# EAGLE schematic smoothieboard-10x10-1210 (EAGLE 9.6.0)

## Sheet 1 of 4
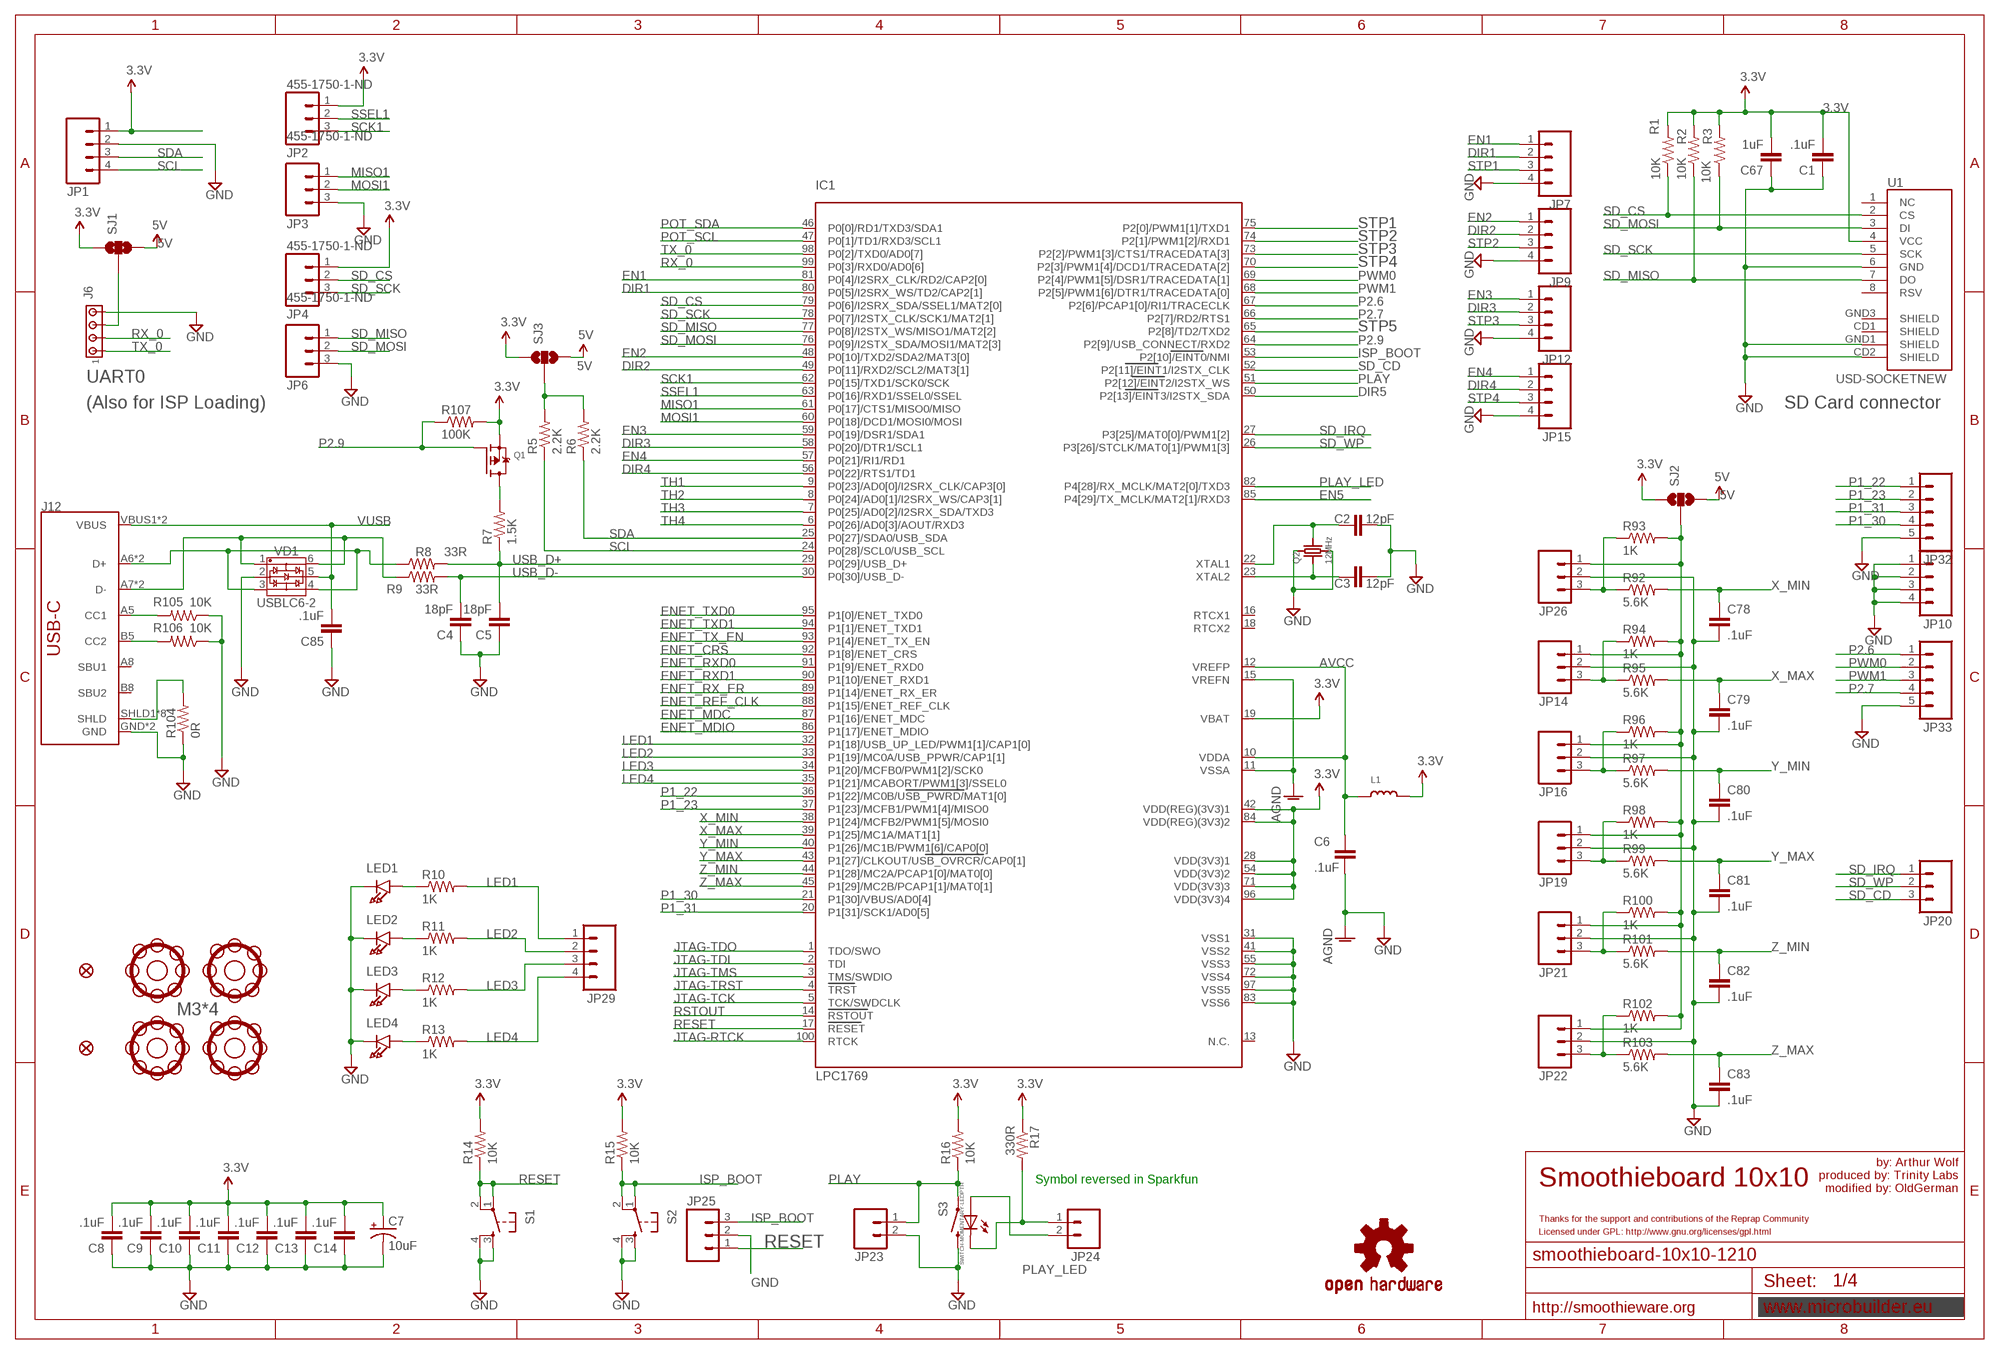
[diagram p0: schematic, sheet 1]

### Parts
C1  .1uF  C-EU  [0603]
C2  12pF  C-EU  [0603]
C3  12pF  C-EU  [0603]
C4  18pF  C-EU  [0603]
C5  18pF  C-EU  [0603]
C6  .1uF  C-EU  [0603]
C7  10uF  CAP_POL1206  [EIA3216]
C8  .1uF  C-EU  [0603]
C9  .1uF  C-EU  [0603]
C10  .1uF  C-EU  [0603]
C11  .1uF  C-EU  [0603]
C12  .1uF  C-EU  [0603]
C13  .1uF  C-EU  [0603]
C14  .1uF  C-EU  [0603]
C67  1uF  C-EUC0603  [C0603]
C78  .1uF  C-EU  [0603]
C79  .1uF  C-EU  [0603]
C80  .1uF  C-EU  [0603]
C81  .1uF  C-EU  [0603]
C82  .1uF  C-EU  [0603]
C83  .1uF  C-EU  [0603]
C85  .1uF  C-EU  [0603]
FID1  FIDUCIAL  [FIDUCIAL_1MM]
FID2  FIDUCIAL  [FIDUCIAL_1MM]
IC1  LPC1769  LPC1768  [LQFP100]
J6  MTA04-100  [10X04MTA_ROUND]
J12  USB_C_LONG-SYMBOL2-LAYER  [USB-C-16P]
JP1  CONN_04PTH  [1X04]
JP2  455-1750-1-ND  CONN_03  [1X03]
JP3  455-1750-1-ND  CONN_03  [1X03]
JP4  455-1750-1-ND  CONN_03  [1X03]
JP6  455-1750-1-ND  CONN_03  [1X03]
JP7  CONN_04PTH  [1X04]
JP9  CONN_04PTH  [1X04]
JP10  CONN_04PTH  [1X04]
JP12  CONN_04PTH  [1X04]
JP14  M03POLAR  [MOLEX-1X3]
JP15  CONN_04PTH  [1X04]
JP16  M03POLAR  [MOLEX-1X3]
JP19  M03POLAR  [MOLEX-1X3]
JP20  M03PTH  [1X03]
JP21  M03POLAR  [MOLEX-1X3]
JP22  M03POLAR  [MOLEX-1X3]
JP23  M02PTH  [1X02]
JP24  M02PTH  [1X02]
JP25  M03PTH  [1X03@1]
JP26  M03POLAR  [MOLEX-1X3]
JP29  CONN_04PTH  [1X04]
JP32  M05PTH  [1X05]
JP33  M05PTH  [1X05]
L1  INDUCTOR0603  [0603]
LED1  LED0805  [CHIPLED_0805]
LED2  LED0805  [CHIPLED_0805]
LED3  LED0805  [CHIPLED_0805]
LED4  LED0805  [CHIPLED_0805]
Q1  MOSFET-P  [SOT23-R]
Q2  12MHz  CRYSTALTHIN  [CRYSTAL_3.2X2.5]
R1  10K  R-US_  [0603]
R2  10K  R-US_  [0603]
R3  10K  R-US_  [0603]
R5  2.2K  R-US_  [0603]
R6  2.2K  R-US_  [0603]
R7  1.5K  R-US_  [0603]
R8  33R  R-US_  [0603]
R9  33R  R-US_  [0603]
R10  1K  R-US_  [0603]
R11  1K  R-US_  [0603]
R12  1K  R-US_  [0603]
R13  1K  R-US_  [0603]
R14  10K  R-US_  [0603]
R15  10K  R-US_  [0603]
R16  10K  R-US_  [0603]
R17  330R  R-US_  [0603]
R92  5.6K  R-US_  [0603]
R93  1K  R-US_  [0603]
R94  1K  R-US_  [0603]
R95  5.6K  R-US_  [0603]
R96  1K  R-US_  [0603]
R97  5.6K  R-US_  [0603]
R98  1K  R-US_  [0603]
R99  5.6K  R-US_  [0603]
R100  1K  R-US_  [0603]
R101  5.6K  R-US_  [0603]
R102  1K  R-US_  [0603]
R103  5.6K  R-US_  [0603]
R104  0R  R-US_  [0603]
R105  10K  R-US_  [0603]
R106  10K  R-US_  [0603]
R107  100K  R-US_  [0603]
S1  TAC_SWITCHSMD  [TACTILE_SWITCH_SMD]
S2  TAC_SWITCHSMD  [TACTILE_SWITCH_SMD]
S3  SWITCH-MOMENTARY-LEDPTH  [TACTILE-PTH-LED-12MM]
SJ1  SOLDERJUMPER_2WAYS  [SJ_3]
SJ2  SOLDERJUMPER_2WAYS  [SJ_3]
SJ3  SOLDERJUMPER_2WAYS  [SJ_3]
U1  USD-SOCKETNEW  [MICRO-SD-SOCKET-PP]
U$9  OSHW-LOGOH  [OSHW-LOGO-HUGE]
U$13  SUN_HOLE_M3  [SUN_HOLE_M3]
U$14  SUN_HOLE_M3  [SUN_HOLE_M3]
U$16  SUN_HOLE_M3  [SUN_HOLE_M3]
U$18  SUN_HOLE_M3  [SUN_HOLE_M3]
VD1  USBLC6-2  USBLC6-2SOT23-6  [SOT23-6]

### Nets
3.3V: C1.2 C7.A(+) C8.2 C9.2 C10.2 C11.2 C12.2 C13.2 C14.2 C67.2 IC1.19(VBAT) IC1.28(VDD(3V3)1) IC1.42(VDD(REG)(3V3)1) IC1.54(VDD(3V3)2) IC1.71(VDD(3V3)3) IC1.84(VDD(REG)(3V3)2) IC1.96(VDD(3V3)4) JP1.1 JP2.1 JP4.1 L1.2 Q1.2(S) R1.2 R2.2 R3.2 R14.2 R15.2 R16.2 R17.1 R107.2 SJ1.1 SJ2.1 SJ3.1 U1.4(VCC) ; also sheet 2,3,4
5V: SJ1.3 SJ2.3 SJ3.3 ; also sheet 4
AGND: C6.2 IC1.11(VSSA) IC1.15(VREFN) ; supply symbol labelled GND ; also sheet 2
AVCC: C6.1 IC1.10(VDDA) IC1.12(VREFP) L1.1 ; also sheet 2
DIR1: IC1.80(P0[5]/I2SRX_WS/TD2/CAP2[1]) JP7.2 ; also sheet 2
DIR2: IC1.49(P0[11]/RXD2/SCL2/MAT3[1]) JP9.2 ; also sheet 2
DIR3: IC1.58(P0[20]/DTR1/SCL1) JP12.2 ; also sheet 2
DIR4: IC1.56(P0[22]/RTS1/TD1) JP15.2 ; also sheet 2
DIR5: IC1.50(P2[13]/EINT3/I2STX_SDA) ; also sheet 4
EN1: IC1.81(P0[4]/I2SRX_CLK/RD2/CAP2[0]) JP7.1 ; also sheet 2
EN2: IC1.48(P0[10]/TXD2/SDA2/MAT3[0]) JP9.1 ; also sheet 2
EN3: IC1.59(P0[19]/DSR1/SDA1) JP12.1 ; also sheet 2
EN4: IC1.57(P0[21]/RI1/RD1) JP15.1 ; also sheet 2
EN5: IC1.85(P4[29]/TX_MCLK/MAT2[1]/RXD3) ; also sheet 4
ENET_CRS: IC1.92(P1[8]/ENET_CRS) ; also sheet 3
ENET_MDC: IC1.87(P1[16]/ENET_MDC) ; also sheet 3
ENET_MDIO: IC1.86(P1[17]/ENET_MDIO) ; also sheet 3
ENET_REF_CLK: IC1.88(P1[15]/ENET_REF_CLK) ; also sheet 3
ENET_RX_ER: IC1.89(P1[14]/ENET_RX_ER) ; also sheet 3
ENET_RXD0: IC1.91(P1[9]/ENET_RXD0) ; also sheet 3
ENET_RXD1: IC1.90(P1[10]/ENET_RXD1) ; also sheet 3
ENET_TX_EN: IC1.93(P1[4]/ENET_TX_EN) ; also sheet 3
ENET_TXD0: IC1.95(P1[0]/ENET_TXD0) ; also sheet 3
ENET_TXD1: IC1.94(P1[1]/ENET_TXD1) ; also sheet 3
GND: C1.1 C2.2 C3.2 C4.1 C5.1 C7.C(-) C8.1 C9.1 C10.1 C11.1 C12.1 C13.1 C14.1 C67.1 C78.2 C79.2 C80.2 C81.2 C82.2 C83.2 C85.1 IC1.31(VSS1) IC1.41(VSS2) IC1.55(VSS3) IC1.72(VSS4) IC1.83(VSS6) IC1.97(VSS5) J6.4 J12.GND J12.GND2(GND) JP1.2 JP3.3 JP6.3 JP7.4 JP9.4 JP10.1 JP10.2 JP10.3 JP10.4 JP12.4 JP14.2 JP15.4 JP16.2 JP19.2 JP21.2 JP22.2 JP23.2 JP25.2 JP26.2 JP32.5 JP33.5 LED1.C LED2.C LED3.C LED4.C Q2.GND1 Q2.GND2 R104.1 R105.1 R106.1 S1.3 S1.4 S2.3 S2.4 S3.2 U1.6(GND) U1.CD2(SHIELD) U1.GND1(SHIELD) VD1.2 ; also sheet 2,3,4
ISP_BOOT: IC1.53(P2[10]/EINT0/NMI) JP25.3 R15.1 S2.1 S2.2
JTAG-RTCK: IC1.100(RTCK)
JTAG-TCK: IC1.5(TCK/SWDCLK)
JTAG-TDI: IC1.2(TDI)
JTAG-TDO: IC1.1(TDO/SWO)
JTAG-TMS: IC1.3(TMS/SWDIO)
JTAG-TRST: IC1.4(TRST)
LED1: IC1.32(P1[18]/USB_UP_LED/PWM1[1]/CAP1[0]) JP29.1 R10.2
LED2: IC1.33(P1[19]/MC0A/USB_PPWR/CAP1[1]) JP29.2 R11.2
LED3: IC1.34(P1[20]/MCFB0/PWM1[2]/SCK0) JP29.3 R12.2
LED4: IC1.35(P1[21]/MCABORT/PWM1[3]/SSEL0) JP29.4 R13.2
MISO1: IC1.61(P0[17]/CTS1/MISO0/MISO) JP3.1
MOSI1: IC1.60(P0[18]/DCD1/MOSI0/MOSI) JP3.2
N$1: C2.1 IC1.22(XTAL1) Q2.2
N$2: C3.1 IC1.23(XTAL2) Q2.1
N$23: J6.3 SJ1.2
N$51: Q1.3(D) R7.2
N$61: J12.A6(D+) J12.B6(D+) R8.1 VD1.3 VD1.4
N$62: J12.A7(D-) J12.B7(D-) R9.1 VD1.1 VD1.6
N$73: JP24.1 R17.2 S3.C
N$84: LED4.A R13.1
N$85: LED3.A R12.1
N$86: LED2.A R11.1
N$87: LED1.A R10.1
N$114: JP14.3 R94.1 R95.1
N$115: JP14.1 JP16.1 JP19.1 JP21.1 JP22.1 JP26.1 R93.2 R94.2 R96.2 R98.2 R100.2 R102.2 SJ2.2
N$116: JP16.3 R96.1 R97.1
N$117: JP19.3 R98.1 R99.1
N$118: JP22.3 R102.1 R103.1
N$119: JP21.3 R100.1 R101.1
N$122: JP26.3 R92.1 R93.1
N$124: R5.2 R6.2 SJ3.2
N$127: J12.A5(CC1) R105.2
N$128: J12.B5(CC2) R106.2
P1_22: IC1.36(P1[22]/MC0B/USB_PWRD/MAT1[0]) JP32.1 ; also sheet 4
P1_23: IC1.37(P1[23]/MCFB1/PWM1[4]/MISO0) JP32.2 ; also sheet 4
P1_30: IC1.21(P1[30]/VBUS/AD0[4]) JP32.4
P1_31: IC1.20(P1[31]/SCK1/AD0[5]) JP32.3
P2.6: IC1.67(P2[6]/PCAP1[0]/RI1/TRACECLK) JP33.1 ; also sheet 3
P2.7: IC1.66(P2[7]/RD2/RTS1) JP33.4 ; also sheet 3
P2.9: IC1.64(P2[9]/USB_CONNECT/RXD2) Q1.1(G) R107.1
PLAY: IC1.51(P2[12]/EINT2/I2STX_WS) JP23.1 R16.1 S3.4
PLAY_LED: IC1.82(P4[28]/RX_MCLK/MAT2[0]/TXD3) JP24.2 S3.A
POT_SCL: IC1.47(P0[1]/TD1/RXD3/SCL1) ; also sheet 2,4
POT_SDA: IC1.46(P0[0]/RD1/TXD3/SDA1) ; also sheet 2,4
PWM0: IC1.69(P2[4]/PWM1[5]/DSR1/TRACEDATA[1]) JP33.2 ; also sheet 3
PWM1: IC1.68(P2[5]/PWM1[6]/DTR1/TRACEDATA[0]) JP33.3 ; also sheet 3
RESET: IC1.17(RESET) JP25.1 R14.1 S1.1 S1.2
RSTOUT: IC1.14(RSTOUT) ; also sheet 3
RX_0: IC1.99(P0[3]/RXD0/AD0[6]) J6.2
SCK1: IC1.62(P0[15]/TXD1/SCK0/SCK) JP2.3
SCL: IC1.24(P0[28]/SCL0/USB_SCL) JP1.4 R5.1
SD_CD: IC1.52(P2[11]/EINT1/I2STX_CLK) JP20.3
SD_CS: IC1.79(P0[6]/I2SRX_SDA/SSEL1/MAT2[0]) JP4.2 R1.1 U1.2(CS)
SD_IRQ: IC1.27(P3[25]/MAT0[0]/PWM1[2]) JP20.1
SD_MISO: IC1.77(P0[8]/I2STX_WS/MISO1/MAT2[2]) JP6.1 R2.1 U1.7(DO)
SD_MOSI: IC1.76(P0[9]/I2STX_SDA/MOSI1/MAT2[3]) JP6.2 R3.1 U1.3(DI)
SD_SCK: IC1.78(P0[7]/I2STX_CLK/SCK1/MAT2[1]) JP4.3 U1.5(SCK)
SD_WP: IC1.26(P3[26]/STCLK/MAT0[1]/PWM1[3]) JP20.2
SDA: IC1.25(P0[27]/SDA0/USB_SDA) JP1.3 R6.1
SHLD: J12.SHLD1(SHLD) J12.SHLD2(SHLD) J12.SHLD3(SHLD) J12.SHLD4(SHLD) J12.SHLD5(SHLD) J12.SHLD6(SHLD) J12.SHLD7(SHLD) J12.SHLD8(SHLD) R104.2
SSEL1: IC1.63(P0[16]/RXD1/SSEL0/SSEL) JP2.2
STP1: IC1.75(P2[0]/PWM1[1]/TXD1) JP7.3 ; also sheet 2
STP2: IC1.74(P2[1]/PWM1[2]/RXD1) JP9.3 ; also sheet 2
STP3: IC1.73(P2[2]/PWM1[3]/CTS1/TRACEDATA[3]) JP12.3 ; also sheet 2
STP4: IC1.70(P2[3]/PWM1[4]/DCD1/TRACEDATA[2]) JP15.3 ; also sheet 2
STP5: IC1.65(P2[8]/TD2/TXD2) ; also sheet 4
TH1: IC1.9(P0[23]/AD0[0]/I2SRX_CLK/CAP3[0]) ; also sheet 2
TH2: IC1.8(P0[24]/AD0[1]/I2SRX_WS/CAP3[1]) ; also sheet 2
TH3: IC1.7(P0[25]/AD0[2]/I2SRX_SDA/TXD3) ; also sheet 2
TH4: IC1.6(P0[26]/AD0[3]/AOUT/RXD3) ; also sheet 2
TX_0: IC1.98(P0[2]/TXD0/AD0[7]) J6.1
USB_D+: C5.2 IC1.29(P0[29]/USB_D+) R7.1 R8.2
USB_D-: C4.2 IC1.30(P0[30]/USB_D-) R9.2
VUSB: C85.2 J12.VBUS1(VBUS) J12.VBUS2(VBUS) VD1.5 ; also sheet 4
X_MAX: C79.1 IC1.39(P1[25]/MC1A/MAT1[1]) R95.2
X_MIN: C78.1 IC1.38(P1[24]/MCFB2/PWM1[5]/MOSI0) R92.2
Y_MAX: C81.1 IC1.43(P1[27]/CLKOUT/USB_OVRCR/CAP0[1]) R99.2
Y_MIN: C80.1 IC1.40(P1[26]/MC1B/PWM1[6]/CAP0[0]) R97.2
Z_MAX: C83.1 IC1.45(P1[29]/MC2B/PCAP1[1]/MAT0[1]) R103.2
Z_MIN: C82.1 IC1.44(P1[28]/MC2A/PCAP1[0]/MAT0[0]) R101.2
Unconnected: IC1.13(N.C.) IC1.16(RTCX1) IC1.18(RTCX2) J12.A8(SBU1) J12.B8(SBU2) U1.1(NC) U1.8(RSV) U1.CD1(SHIELD) U1.GND3(SHIELD)

### Notes on the sheet
- UART0
- (Also for ISP Loading) | SD Card connector
- M3*4
- by: Arthur Wolf
- produced by: Trinity Labs
- Symbol reversed in Sparkfun | Smoothieboard 10x10 | modified by: OldGerman
- Thanks for the support and contributions of the Reprap Community
- Licensed under GPL: http://www.gnu.org/licenses/gpl.html
- http://smoothieware.org

## Sheet 2 of 4
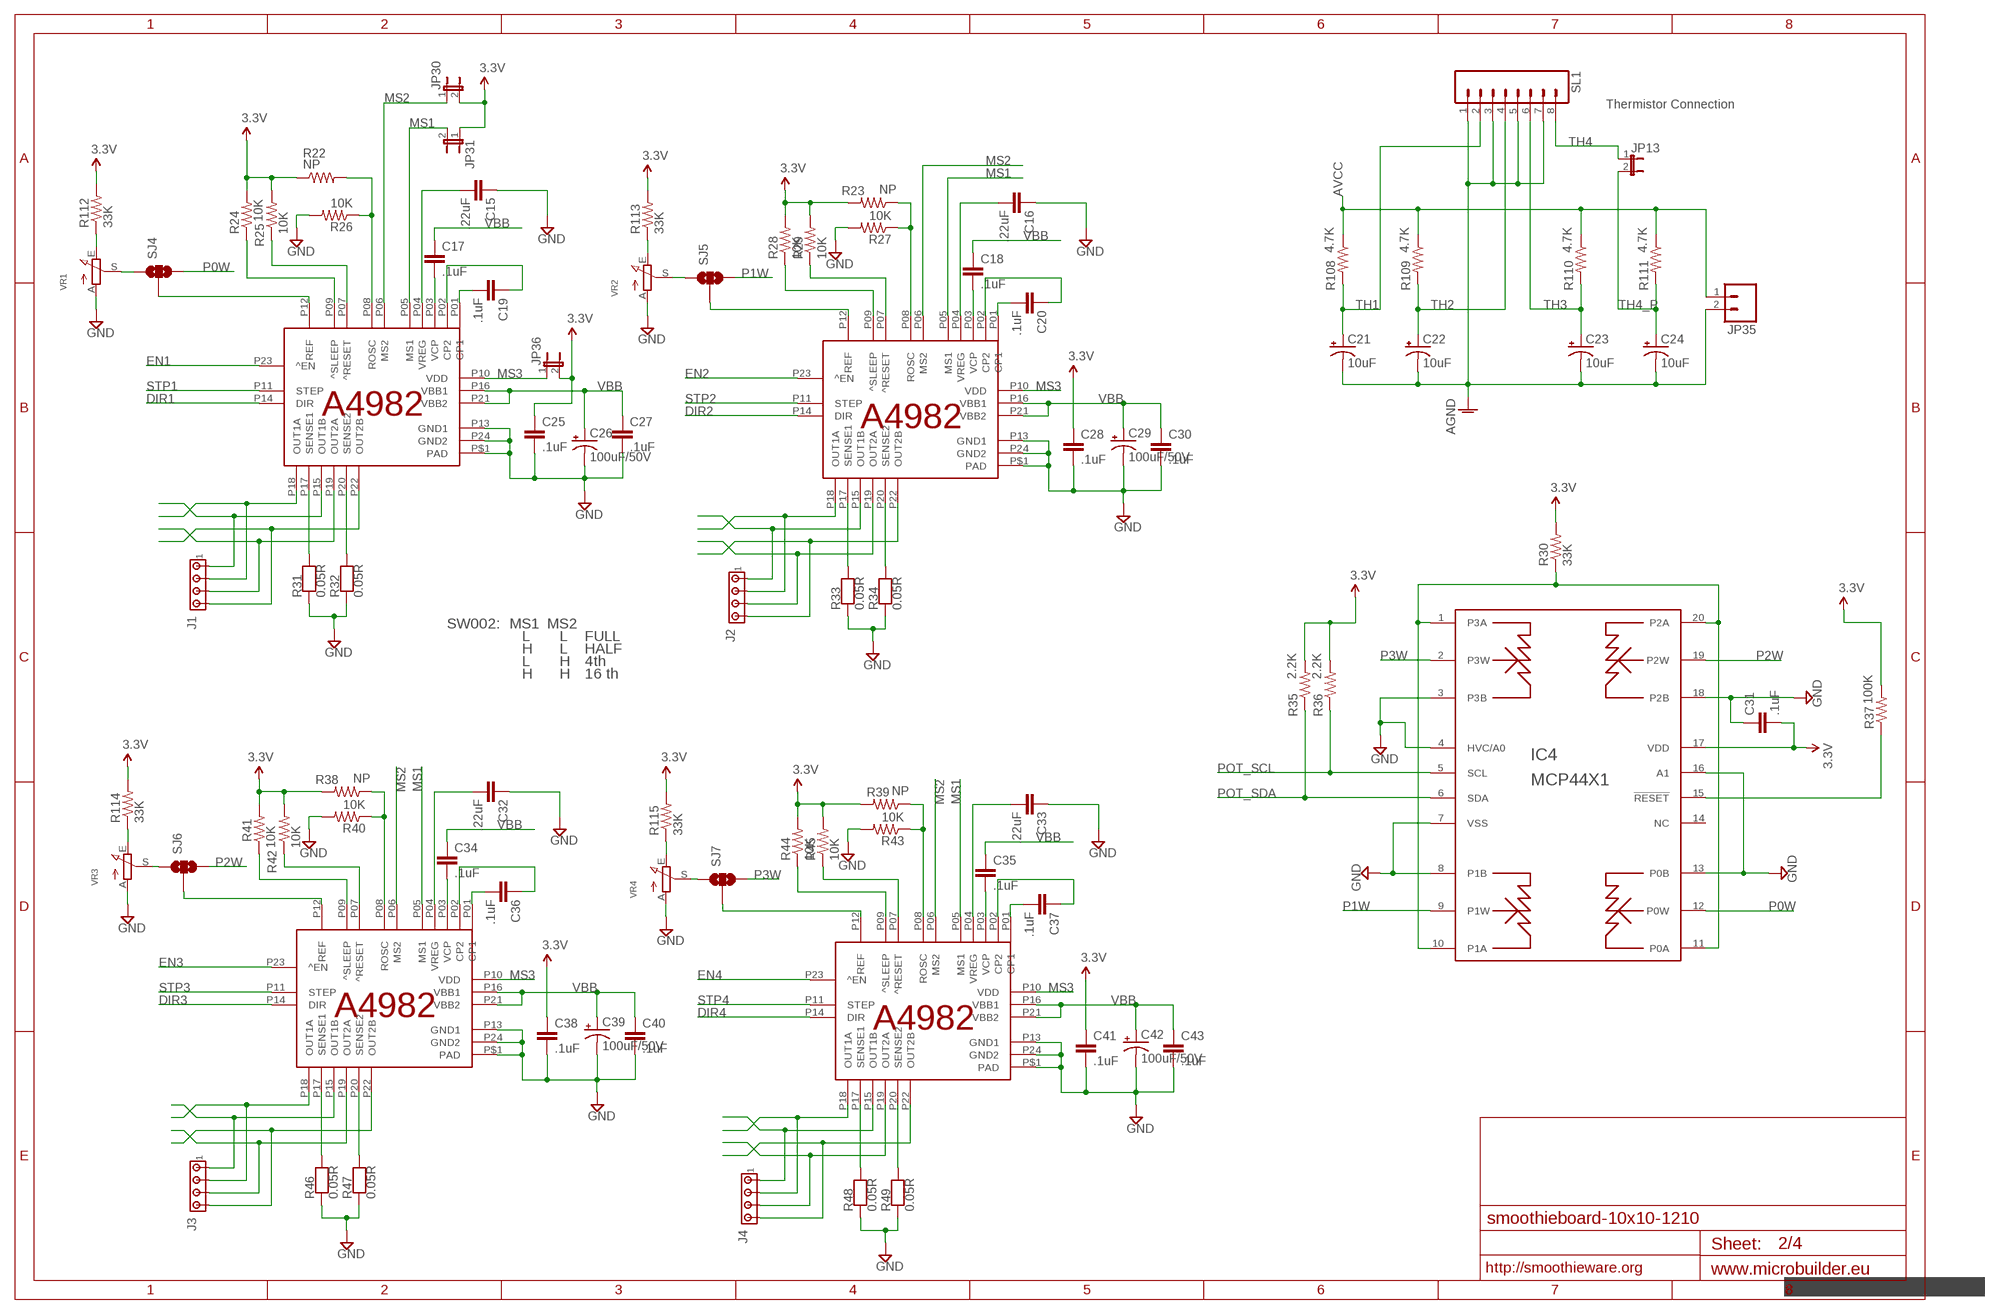
[diagram p1: schematic, sheet 2]

### Parts
C15  .22uF  C-EU  [0603]
C16  .22uF  C-EU  [0603]
C17  .1uF  C-EU  [0603]
C18  .1uF  C-EU  [0603]
C19  .1uF  C-EU  [0603]
C20  .1uF  C-EU  [0603]
C21  10uF  CAP_POL1206  [EIA3216]
C22  10uF  CAP_POL1206  [EIA3216]
C23  10uF  CAP_POL1206  [EIA3216]
C24  10uF  CAP_POL1206  [EIA3216]
C25  .1uF  C-EU  [0603]
C26  100uF/50V  CAP_POL-MINIE  [PANASONIC_E]
C27  .1uF  C-EU  [0603]
C28  .1uF  C-EU  [0603]
C29  100uF/50V  CAP_POL-MINIE  [PANASONIC_E]
C30  .1uF  C-EU  [0603]
C31  .1uF  C-EU  [0603]
C32  .22uF  C-EU  [0603]
C33  .22uF  C-EU  [0603]
C34  .1uF  C-EU  [0603]
C35  .1uF  C-EU  [0603]
C36  .1uF  C-EU  [0603]
C37  .1uF  C-EU  [0603]
C38  .1uF  C-EU  [0603]
C39  100uF/50V  CAP_POL-MINIE  [PANASONIC_E]
C40  .1uF  C-EU  [0603]
C41  .1uF  C-EU  [0603]
C42  100uF/50V  CAP_POL-MINIE  [PANASONIC_E]
C43  .1uF  C-EU  [0603]
IC2  A5984  A4982  [ETSSOP24]
IC3  A5984  A4982  [ETSSOP24]
IC4  MCP44X1  [TSSOP20]
IC5  A5984  A4982  [ETSSOP24]
IC6  A5984  A4982  [ETSSOP24]
J1  MTA04-100  [10X04MTA]
J2  MTA04-100  [10X04MTA]
J3  MTA04-100  [10X04MTA]
J4  MTA04-100  [10X04MTA]
JP13  JUMPER-2SMD-NC  [SJ_2S]
JP30  JUMPER-2SMD-NC  [SJ_2S]
JP31  JUMPER-2SMD-NC  [SJ_2S]
JP35  M02PTH  [1X02]
JP36  JUMPER-2SMD-NC  [SJ_2S]
R22  NP  R-US_  [0603]
R23  NP  R-US_  [0603]
R24  10K  R-US_  [0603]
R25  10K  R-US_  [0603]
R26  10K  R-US_  [0603]
R27  10K  R-US_  [0603]
R28  10K  R-US_  [0603]
R29  10K  R-US_  [0603]
R30  33K  R-US_  [0603]
R31  0.05R  RESISTOR1206  [1206]
R32  0.05R  RESISTOR1206  [1206]
R33  0.05R  RESISTOR1206  [1206]
R34  0.05R  RESISTOR1206  [1206]
R35  2.2K  R-US_  [0603]
R36  2.2K  R-US_  [0603]
R37  100K  R-US_  [0603]
R38  NP  R-US_  [0603]
R39  NP  R-US_  [0603]
R40  10K  R-US_  [0603]
R41  10K  R-US_  [0603]
R42  10K  R-US_  [0603]
R43  10K  R-US_  [0603]
R44  10K  R-US_  [0603]
R45  10K  R-US_  [0603]
R46  0.05R  RESISTOR1206  [1206]
R47  0.05R  RESISTOR1206  [1206]
R48  0.05R  RESISTOR1206  [1206]
R49  0.05R  RESISTOR1206  [1206]
R108  4.7K  R-US_  [0603]
R109  4.7K  R-US_  [0603]
R110  4.7K  R-US_  [0603]
R111  4.7K  R-US_  [0603]
R112  33K  R-US_  [0603]
R113  33K  R-US_  [0603]
R114  33K  R-US_  [0603]
R115  33K  R-US_  [0603]
SJ4  SOLDERJUMPER_2WAYS  [SJ_3]
SJ5  SOLDERJUMPER_2WAYS  [SJ_3]
SJ6  SOLDERJUMPER_2WAYS  [SJ_3]
SJ7  SOLDERJUMPER_2WAYS  [SJ_3]
SL1  CONN_08"  [1X08]
VR1  TRIMPOT10K_BOURNS  [TRIMPOT_BOURNS3MM]
VR2  TRIMPOT10K_BOURNS  [TRIMPOT_BOURNS3MM]
VR3  TRIMPOT10K_BOURNS  [TRIMPOT_BOURNS3MM]
VR4  TRIMPOT10K_BOURNS  [TRIMPOT_BOURNS3MM]

### Nets
3.3V: C25.1 C28.1 C31.2 C38.1 C41.1 IC4.17(VDD) JP30.2 JP31.1 JP36.2 R22.1 R23.2 R24.2 R25.2 R28.2 R29.2 R30.2 R35.2 R36.2 R37.2 R38.2 R39.2 R41.2 R42.2 R44.2 R45.2 R112.2 R113.2 R114.2 R115.2 ; also sheet 1,3,4
AGND: C21.C(-) C22.C(-) C23.C(-) C24.C(-) JP35.2 SL1.1 SL1.3 SL1.5 SL1.7 ; also sheet 1
AVCC: JP35.1 R108.1 R109.1 R110.1 R111.1 ; also sheet 1
DIR1: IC2.P14(DIR) ; also sheet 1
DIR2: IC3.P14(DIR) ; also sheet 1
DIR3: IC5.P14(DIR) ; also sheet 1
DIR4: IC6.P14(DIR) ; also sheet 1
EN1: IC2.P23(^EN) ; also sheet 1
EN2: IC3.P23(^EN) ; also sheet 1
EN3: IC5.P23(^EN) ; also sheet 1
EN4: IC6.P23(^EN) ; also sheet 1
GND: C15.1 C16.1 C25.2 C26.- C27.2 C28.2 C29.- C30.2 C31.1 C32.1 C33.1 C38.2 C39.- C40.2 C41.2 C42.- C43.2 IC2.P13(GND1) IC2.P24(GND2) IC2.P$1(PAD) IC3.P13(GND1) IC3.P24(GND2) IC3.P$1(PAD) IC4.3(P3B) IC4.4(HVC/A0) IC4.7(VSS) IC4.8(P1B) IC4.13(P0B) IC4.16(A1) IC4.18(P2B) IC5.P13(GND1) IC5.P24(GND2) IC5.P$1(PAD) IC6.P13(GND1) IC6.P24(GND2) IC6.P$1(PAD) R26.2 R27.2 R31.1 R32.1 R33.1 R34.1 R40.2 R43.2 R46.1 R47.1 R48.1 R49.1 VR1.A VR2.A VR3.A VR4.A ; also sheet 1,3,4
MS1: IC2.P05(MS1) IC3.P05(MS1) IC5.P05(MS1) IC6.P05(MS1) JP31.2 ; also sheet 4
MS2: IC2.P06(MS2) IC3.P06(MS2) IC5.P06(MS2) IC6.P06(MS2) JP30.1 ; also sheet 4
MS3: IC2.P10(VDD) IC3.P10(VDD) IC5.P10(VDD) IC6.P10(VDD) JP36.1 ; also sheet 4
N$3: C20.2 IC3.P01(CP1)
N$4: C20.1 IC3.P02(CP2)
N$6: IC2.P07(^RESET) R25.1
N$7: C18.2 IC3.P03(VCP)
N$8: IC3.P17(SENSE1) R33.2
N$9: IC3.P20(SENSE2) R34.2
N$10: IC3.P18(OUT1A) J2.2
N$11: IC3.P15(OUT1B) J2.1
N$12: IC3.P19(OUT2A) J2.3
N$13: IC4.15(!RESET) R37.1
N$14: IC3.P22(OUT2B) J2.4
N$15: IC4.1(P3A) IC4.10(P1A) IC4.11(P0A) IC4.20(P2A) R30.1
N$17: IC3.P08(ROSC) R23.1 R27.1
N$22: C16.2 IC3.P04(VREG)
N$24: IC3.P09(^SLEEP) R28.1
N$25: C36.2 IC5.P01(CP1)
N$26: C36.1 IC5.P02(CP2)
N$27: C34.2 IC5.P03(VCP)
N$28: IC5.P17(SENSE1) R46.2
N$30: IC5.P20(SENSE2) R47.2
N$31: IC5.P18(OUT1A) J3.2
N$32: IC5.P15(OUT1B) J3.1
N$33: IC5.P19(OUT2A) J3.3
N$34: IC5.P22(OUT2B) J3.4
N$35: IC3.P07(^RESET) R29.1
N$36: IC5.P07(^RESET) R42.1
N$37: IC5.P08(ROSC) R38.1 R40.1
N$38: C32.2 IC5.P04(VREG)
N$39: IC6.P07(^RESET) R45.1
N$40: IC5.P09(^SLEEP) R41.1
N$41: C37.2 IC6.P01(CP1)
N$43: C37.1 IC6.P02(CP2)
N$44: C35.2 IC6.P03(VCP)
N$45: IC6.P17(SENSE1) R48.2
N$46: IC6.P20(SENSE2) R49.2
N$48: IC6.P15(OUT1B) J4.1
N$49: IC6.P19(OUT2A) J4.3
N$50: IC6.P22(OUT2B) J4.4
N$53: IC6.P08(ROSC) R39.1 R43.1
N$54: C33.2 IC6.P04(VREG)
N$57: IC6.P09(^SLEEP) R44.1
N$60: IC6.P18(OUT1A) J4.2
N$90: C19.2 IC2.P01(CP1)
N$93: C19.1 IC2.P02(CP2)
N$96: C17.2 IC2.P03(VCP)
N$98: IC2.P17(SENSE1) R31.2
N$99: IC2.P20(SENSE2) R32.2
N$101: IC2.P18(OUT1A) J1.2
N$102: IC2.P15(OUT1B) J1.1
N$103: IC2.P19(OUT2A) J1.3
N$104: IC2.P22(OUT2B) J1.4
N$106: IC2.P08(ROSC) R22.2 R26.1
N$107: C15.2 IC2.P04(VREG)
N$108: IC2.P09(^SLEEP) R24.1
N$121: R112.1 VR1.E
N$123: R113.1 VR2.E
N$125: R114.1 VR3.E
N$126: R115.1 VR4.E
N$130: IC2.P12(REF) SJ4.2
N$131: SJ4.1 VR1.S
N$132: SJ5.1 VR2.S
N$133: IC3.P12(REF) SJ5.2
N$134: SJ6.1 VR3.S
N$135: IC5.P12(REF) SJ6.2
N$136: SJ7.1 VR4.S
N$137: IC6.P12(REF) SJ7.2
P0W: IC4.12(P0W) SJ4.3
P1W: IC4.9(P1W) SJ5.3
P2W: IC4.19(P2W) SJ6.3
P3W: IC4.2(P3W) SJ7.3
POT_SCL: IC4.5(SCL) R36.1 ; also sheet 1,4
POT_SDA: IC4.6(SDA) R35.1 ; also sheet 1,4
STP1: IC2.P11(STEP) ; also sheet 1
STP2: IC3.P11(STEP) ; also sheet 1
STP3: IC5.P11(STEP) ; also sheet 1
STP4: IC6.P11(STEP) ; also sheet 1
TH1: C21.A(+) R108.2 SL1.2 ; also sheet 1
TH2: C22.A(+) R109.2 SL1.4 ; also sheet 1
TH3: C23.A(+) R110.2 SL1.6 ; also sheet 1
TH4: JP13.1 SL1.8 ; also sheet 1
TH4_P: C24.A(+) JP13.2 R111.2
VBB: C17.1 C18.1 C26.+ C27.1 C29.+ C30.1 C34.1 C35.1 C39.+ C40.1 C42.+ C43.1 IC2.P16(VBB1) IC2.P21(VBB2) IC3.P16(VBB1) IC3.P21(VBB2) IC5.P16(VBB1) IC5.P21(VBB2) IC6.P16(VBB1) IC6.P21(VBB2) ; also sheet 3,4
Unconnected: IC4.14(NC)

### Notes on the sheet
- Thermistor Connection
- SW002: | MS1 | MS2
- L | L | FULL
- H | L | HALF
- L | H | 4th
- H | H | 16 th
- http://smoothieware.org

## Sheet 3 of 4
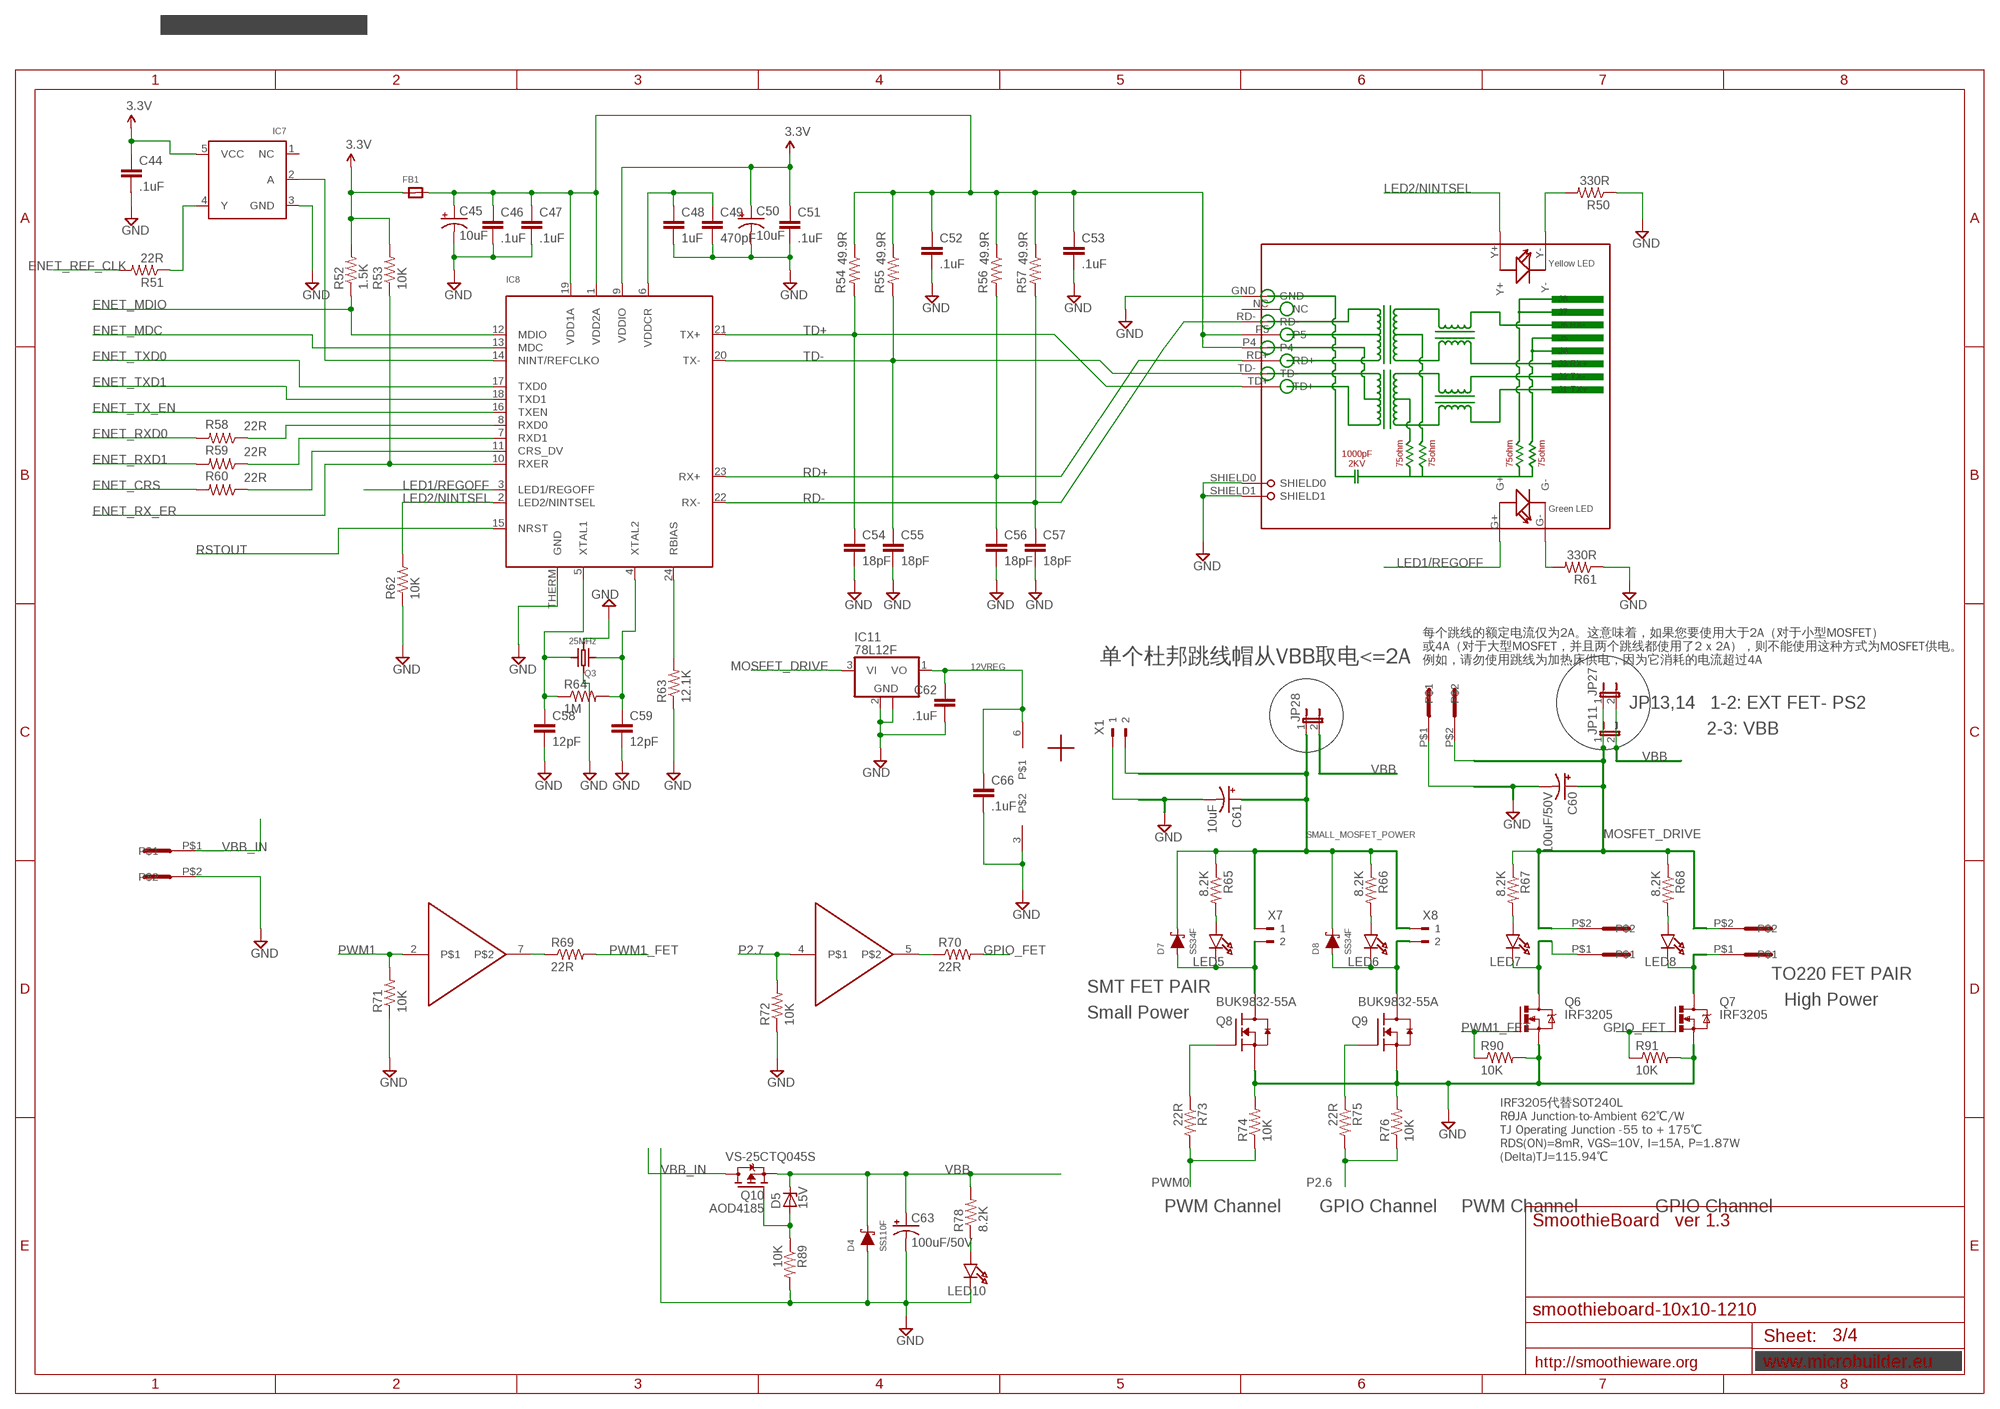
[diagram p2: schematic, sheet 3]

### Parts
C44  .1uF  C-EU  [0603]
C45  10uF  CAP_POL1206  [EIA3216]
C46  .1uF  C-EU  [0603]
C47  .1uF  C-EU  [0603]
C48  1uF  C-EUC0603  [C0603]
C49  470pF  C-EUC0603  [C0603]
C50  10uF  CAP_POL1206  [EIA3216]
C51  .1uF  C-EU  [0603]
C52  .1uF  C-EU  [0603]
C53  .1uF  C-EU  [0603]
C54  18pF  C-EU  [0603]
C55  18pF  C-EU  [0603]
C56  18pF  C-EU  [0603]
C57  18pF  C-EU  [0603]
C58  12pF  C-EU  [0603]
C59  12pF  C-EU  [0603]
C60  100uF/50V  CAP_POL-MINIE  [PANASONIC_E]
C61  10uF  CAP_POL1206  [EIA3216]
C62  .1uF  C-EU  [0603]
C63  100uF/50V  CAP_POL-MINIE  [PANASONIC_E]
C66  .1uF  C-EU  [0603]
D4  SS110F  SS34F  [SMAF]
D5  15V  ZENER-DIODESMB  [SMB]
D7  SS34F  [SMAF]
D8  SS34F  [SMAF]
FB1  FERRITE  [0603]
IC7  74LVC1G04  [SOT23-5]
IC8  LAN8720  [QFN24_4MM]
IC11  78L12F  [SOT89]
IC14  TC4427  [SOIC8]
JP11  JP1E  [JP1]
JP27  JP1E  [JP1]
JP28  JP1E-SMSP  [JP1-SMSP]
LED5  LED0805  [CHIPLED_0805]
LED6  LED0805  [CHIPLED_0805]
LED7  LED0805  [CHIPLED_0805]
LED8  LED0805  [CHIPLED_0805]
LED10  LED0805  [CHIPLED_0805]
POWER  5.08MM_CONN  [1715250000]
Q3  25MHz  CRYSTALTHIN  [CRYSTAL_3.2X2.5]
Q6  IRF3205  IRF540  [TO220BV]
Q7  IRF3205  IRF540  [TO220BV]
Q8  BUK9832-55A  MOSFET-NCH_SOT-223  [SOT230P700X160-4N]
Q9  BUK9832-55A  MOSFET-NCH_SOT-223  [SOT230P700X160-4N]
Q10  AOD4185  SPD30P06PTO252  [TO252]
R50  330R  R-US_  [0603]
R51  22R  R-US_  [0603]
R52  1.5K  R-US_  [0603]
R53  10K  R-US_  [0603]
R54  49.9R  R-US_  [0603]
R55  49.9R  R-US_  [0603]
R56  49.9R  R-US_  [0603]
R57  49.9R  R-US_  [0603]
R58  22R  R-US_  [0603]
R59  22R  R-US_  [0603]
R60  22R  R-US_  [0603]
R61  330R  R-US_  [0603]
R62  10K  R-US_  [0603]
R63  12.1K  R-US_  [0603]
R64  1M  R-US_  [0603]
R65  8.2K  R-US_  [0603]
R66  8.2K  R-US_  [0603]
R67  8.2K  R-US_  [0603]
R68  8.2K  R-US_  [0603]
R69  22R  R-US_  [0603]
R70  22R  R-US_  [0603]
R71  10K  R-US_  [0603]
R72  10K  R-US_  [0603]
R73  22R  R-US_  [0603]
R74  10K  R-US_  [0603]
R75  22R  R-US_  [0603]
R76  10K  R-US_  [0603]
R78  8.2K  R-US_  [0603]
R89  10K  R-US_  [0603]
R90  10K  R-US_  [0603]
R91  10K  R-US_  [0603]
RJ1  HR911105A  [HR911105A]
U$5  5.08MM_CONN-NO-SIDE  [5.08-MOTHER_NO-SIDE]
U$6  5.08MM_CONN-NO-SIDE  [5.08-MOTHER_NO-SIDE]
U$10  5.08MM_CONN-NO-SIDE  [5.08-MOTHER_NO-SIDE]
X1  180G-2  [180G-2]
X7  180G-2  [180G-2]
X8  180G-2  [180G-2]

### Nets
3.3V: C44.1 C50.A(+) C51.1 FB1.1 IC7.5(VCC) IC8.9(VDDIO) R52.2 R53.2 ; also sheet 1,2,4
12VREG: C62.1 C66.1 IC11.1(VO) IC14.6 ; also sheet 4
ENET_CRS: R60.2 ; also sheet 1
ENET_MDC: IC8.13(MDC) ; also sheet 1
ENET_MDIO: IC8.12(MDIO) R52.1 ; also sheet 1
ENET_REF_CLK: R51.2 ; also sheet 1
ENET_RX_ER: IC8.10(RXER) R53.1 ; also sheet 1
ENET_RXD0: R58.2 ; also sheet 1
ENET_RXD1: R59.2 ; also sheet 1
ENET_TX_EN: IC8.16(TXEN) ; also sheet 1
ENET_TXD0: IC8.17(TXD0) ; also sheet 1
ENET_TXD1: IC8.18(TXD1) ; also sheet 1
GND: C44.2 C45.C(-) C46.2 C47.2 C48.2 C49.2 C50.C(-) C51.2 C52.2 C53.2 C54.2 C55.2 C56.2 C57.2 C58.2 C59.2 C60.- C61.C(-) C62.2 C63.- C66.2 D4.A IC7.3(GND) IC8.THERM(GND) IC11.2(GND) IC11.2@1(GND) IC14.3 LED10.C POWER.P$2 Q3.GND1 Q3.GND2 Q6.S Q7.S Q8.3(S) Q9.3(S) R50.1 R61.1 R62.1 R63.1 R71.1 R72.1 R74.2 R76.2 R89.2 R90.2 R91.2 RJ1.GND RJ1.SHIELD0 RJ1.SHIELD1 U$5.P$1 X1.1 ; also sheet 1,2,4
GPIO_FET: Q7.G R70.2 R91.1
LED1/REGOFF: IC8.3(LED1/REGOFF) RJ1.G+
LED2/NINTSEL: IC8.2(LED2/NINTSEL) R62.2 RJ1.Y+
MOSFET_DRIVE: C60.+ IC11.3(VI) JP11.1 JP27.1 R67.1 R68.1 U$5.P$2 U$6.P$2 U$10.P$2
N$5: IC14.7 R69.1
N$16: LED10.A R78.1
N$18: D8.A LED6.C Q9.2(D) Q9.4(D) X8.2
N$19: IC14.5 R70.1
N$20: R61.2 RJ1.G-
N$21: C45.A(+) C46.1 C47.1 C52.1 C53.1 FB1.2 IC8.1(VDD2A) IC8.19(VDD1A) R54.1 R55.1 R56.1 R57.1 RJ1.P4 RJ1.P5
N$42: IC8.8(RXD0) R58.1
N$47: R50.2 RJ1.Y-
N$55: IC8.7(RXD1) R59.1
N$63: IC8.11(CRS_DV) R60.1
N$67: C59.1 IC8.4(XTAL2) Q3.1 R64.2
N$68: C58.1 IC8.5(XTAL1) Q3.2 R64.1
N$69: IC8.24(RBIAS) R63.2
N$74: Q8.1(G) R73.1
N$75: Q9.1(G) R75.1
N$77: IC7.2(A) IC8.14(NINT/REFCLKO)
N$78: IC7.4(Y) R51.1
N$81: LED5.A R65.2
N$82: C48.1 C49.1 IC8.6(VDDCR)
N$88: D7.A LED5.C Q8.2(D) Q8.4(D) X7.2
N$91: LED6.A R66.2
N$92: LED7.C Q6.D U$10.P$1
N$94: LED8.C Q7.D U$6.P$1
N$105: LED7.A R67.2
N$111: D5.A Q10.1(G) R89.1
N$112: LED8.A R68.2
P2.6: R75.2 R76.1 ; also sheet 1
P2.7: IC14.4 R72.2 ; also sheet 1
PWM0: R73.2 R74.1 ; also sheet 1
PWM1: IC14.2 R71.2 ; also sheet 1
PWM1_FET: Q6.G R69.2 R90.1
RD+: C56.1 IC8.23(RX+) R56.2 RJ1.RD+
RD-: C57.1 IC8.22(RX-) R57.2 RJ1.RD-
RSTOUT: IC8.15(NRST) ; also sheet 1
SMALL_MOSFET_POWER: C61.A(+) D7.C D8.C JP28.1 R65.1 R66.1 X1.2 X7.1 X8.1
TD+: C54.1 IC8.21(TX+) R54.2 RJ1.TD+
TD-: C55.1 IC8.20(TX-) R55.2 RJ1.TD-
VBB: C63.+ D4.C D5.C JP11.2 JP27.2 JP28.2 Q10.2(S) R78.2 ; also sheet 2,4
VBB_IN: POWER.P$1 Q10.3(D)
Unconnected: IC7.1(NC) RJ1.NC

### Notes on the sheet
- 单个杜邦跳线帽从VBB取电<=2A
- 每个跳线的额定电流仅为2A。这意味着，如果您要使用大于2A（对于小型MOSFET）
  或4A（对于大型MOSFET，并且两个跳线都使用了2 x 2A），则不能使用这种方式为MOSFET供电。
  例如，请勿使用跳线为加热床供电，因为它消耗的电流超过4A
- JP13,14   1-2: EXT FET- PS2
- 2-3: VBB
- TO220 FET PAIR
- SMT FET PAIR
- High Power
- Small Power
- VS-25CTQ045S
- IRF3205代替SOT240L
  RθJA Junction-to-Ambient 62℃/W
  TJ Operating Junction -55 to + 175℃
  RDS(ON)=8mR, VGS=10V, I=15A, P=1.87W
  (Delta)TJ=115.94℃
- PWM Channel | GPIO Channel | PWM Channel | GPIO Channel
- SmoothieBoard   ver 1.3
- http://smoothieware.org

## Sheet 4 of 4
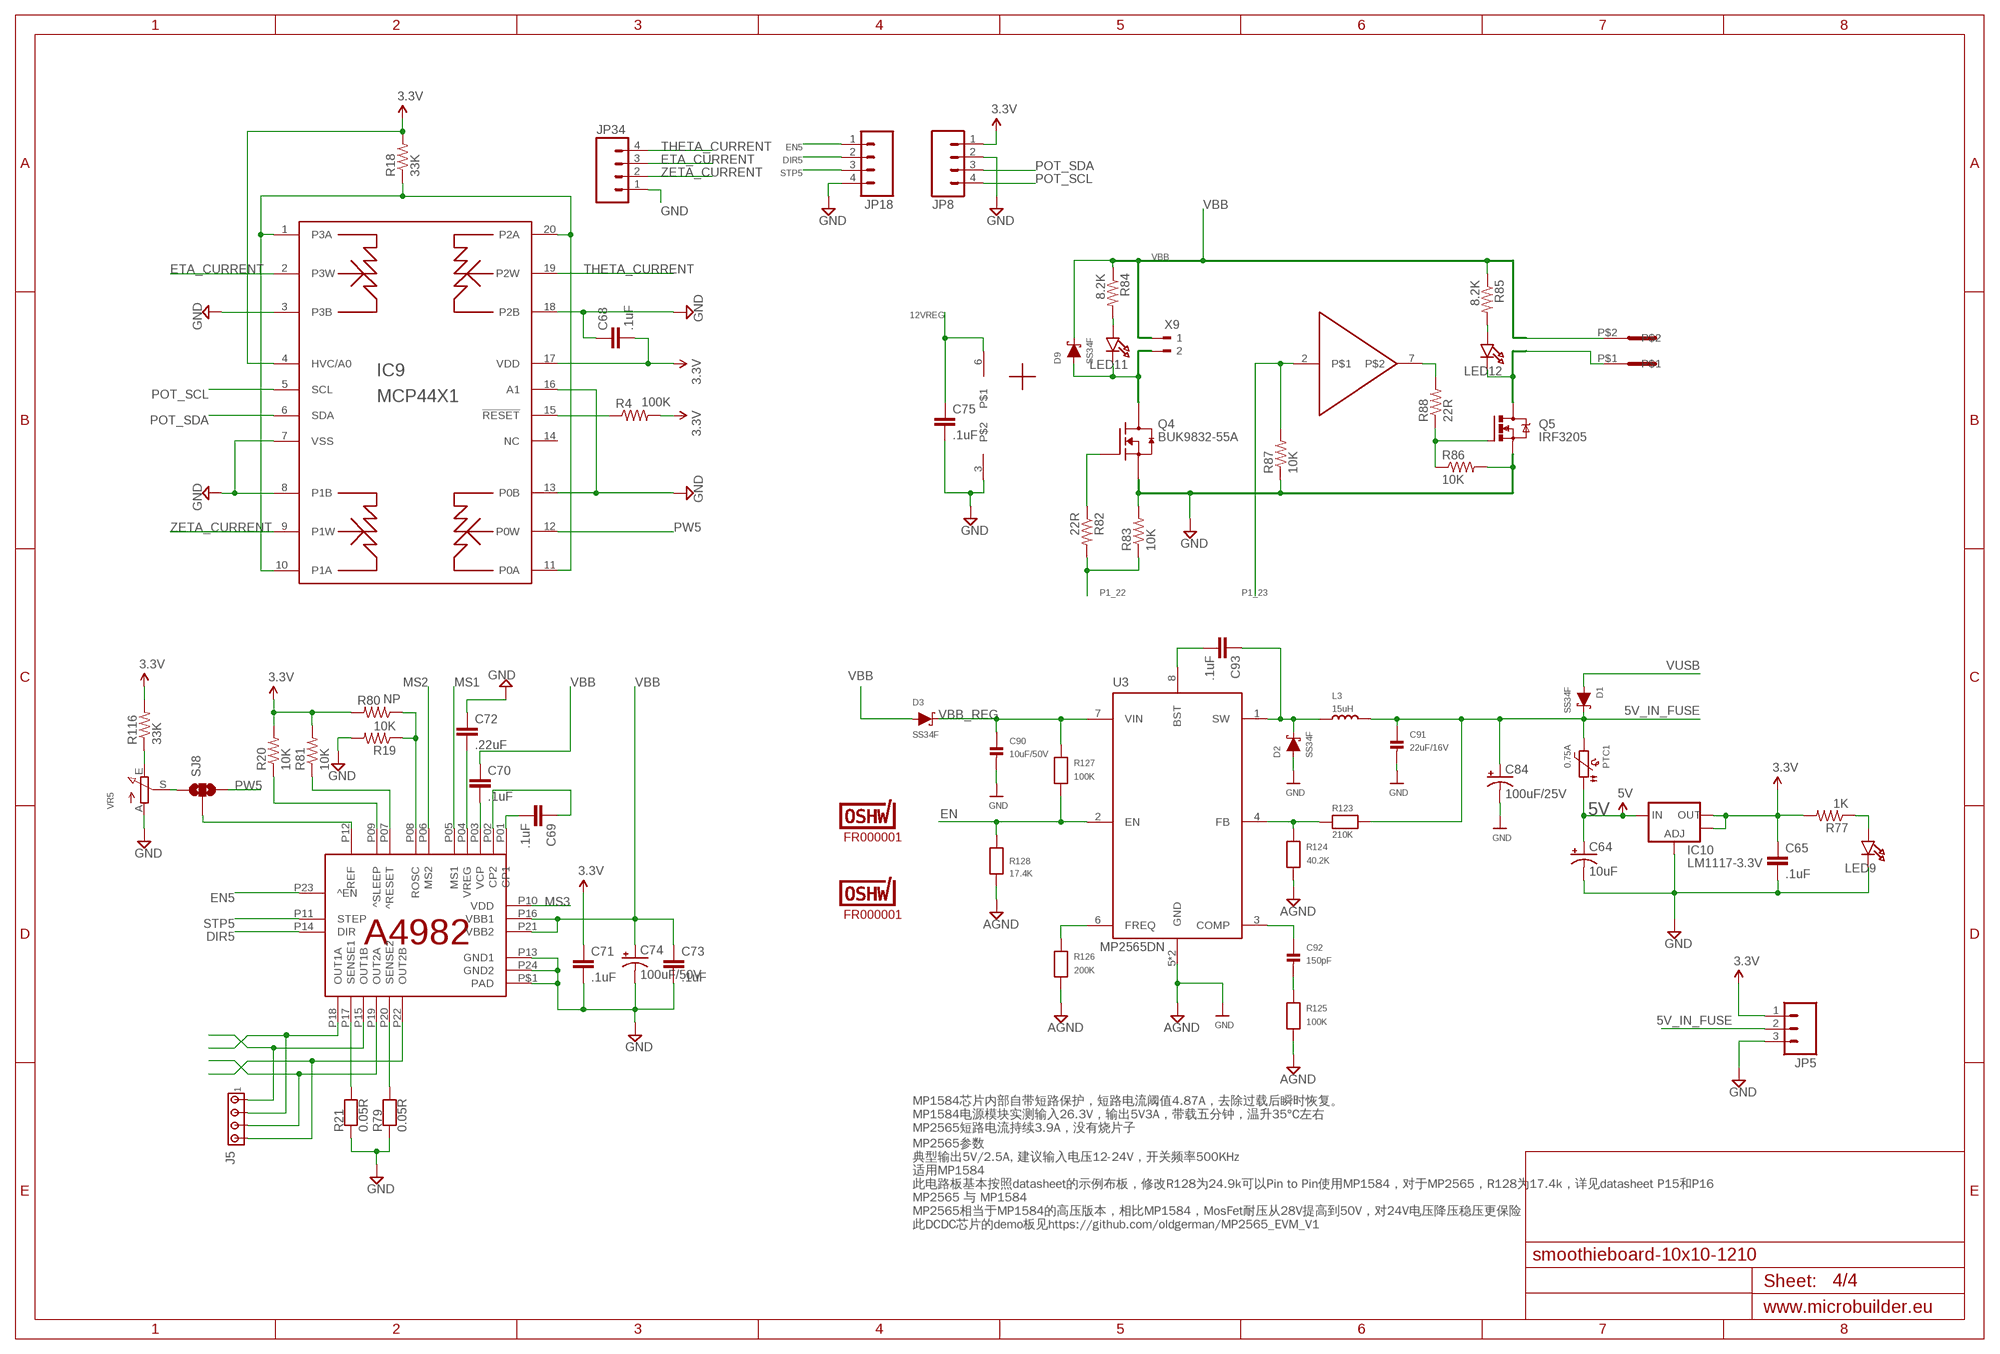
[diagram p3: schematic, sheet 4]

### Parts
C64  10uF  CAP_POL1206  [EIA3216]
C65  .1uF  C-EU  [0603]
C68  .1uF  C-EU  [0603]
C69  .1uF  C-EU  [0603]
C70  .1uF  C-EU  [0603]
C71  .1uF  C-EU  [0603]
C72  .22uF  C-EU  [0603]
C73  .1uF  C-EU  [0603]
C74  100uF/50V  CAP_POL-MINIE  [PANASONIC_E]
C75  .1uF  C-EU  [0603]
C84  100uF/25V  CAP_POLD  [PANASONIC_D]
C90  10uF/50V  CAP_CERAMIC1206  [1206]
C91  22uF/16V  CAP_CERAMIC1206  [1206]
C92  150pF  CAP_CERAMIC0603  [0603]
C93  .1uF  C-EU  [0603]
D1  SS34F  [SMAF]
D2  SS34F  [SMAF]
D3  SS34F  [SMAF]
D9  SS34F  [SMAF]
IC9  MCP44X1  [TSSOP20]
IC10  LM1117-3.3V  V_REG_LM1117SOT223  [SOT223]
IC12  A5984  A4982  [ETSSOP24]
IC15  TC4427  [SOIC8]
J5  MTA04-100  [10X04MTA]
JP5  M03PTH  [1X03]
JP8  CONN_04PTH  [1X04]
JP18  CONN_04PTH  [1X04]
JP34  CONN_04PTH  [1X04]
L3  15uH  INDUCTOR'0630'  [L0630]
LED9  LED0805  [CHIPLED_0805]
LED11  LED0805  [CHIPLED_0805]
LED12  LED0805  [CHIPLED_0805]
PTC1  0.75A  PTC1812  [PTC1812]
Q4  BUK9832-55A  MOSFET-NCH_SOT-223  [SOT230P700X160-4N]
Q5  IRF3205  IRF540  [TO220BV]
R4  100K  R-US_  [0603]
R18  33K  R-US_  [0603]
R19  10K  R-US_  [0603]
R20  10K  R-US_  [0603]
R21  0.05R  RESISTOR1206  [1206]
R77  1K  R-US_  [0603]
R79  0.05R  RESISTOR1206  [1206]
R80  NP  R-US_  [0603]
R81  10K  R-US_  [0603]
R82  22R  R-US_  [0603]
R83  10K  R-US_  [0603]
R84  8.2K  R-US_  [0603]
R85  8.2K  R-US_  [0603]
R86  10K  R-US_  [0603]
R87  10K  R-US_  [0603]
R88  22R  R-US_  [0603]
R116  33K  R-US_  [0603]
R123  210K  RESISTOR0603  [0603]
R124  40.2K  RESISTOR0603  [0603]
R125  100K  RESISTOR0603  [0603]
R126  200K  RESISTOR0603  [0603]
R127  100K  RESISTOR0603  [0603]
R128  17.4K  RESISTOR0603  [0603]
SJ8  SOLDERJUMPER_2WAYS  [SJ_3]
U3  MP2565DN  [ESOP8L-1.27-5X3.9MM]
U$7  5.08MM_CONN  [1715250000]
U$11  FR000001  CERT-SMALL  [CERT-SMALL-SILK]
U$12  FR000001  CERT-MEDIUM  [CERT-MED-SILK]
VR5  TRIMPOT10K_BOURNS  [TRIMPOT_BOURNS3MM]
X9  180G-2  [180G-2]

### Nets
3.3V: C65.1 C68.2 C71.1 IC9.4(HVC/A0) IC9.17(VDD) IC10.2(OUT) IC10.4(OUT) JP5.1 JP8.1 R4.2 R18.2 R20.2 R77.2 R80.2 R81.2 R116.2 ; also sheet 1,2,3
5V: C64.A(+) IC10.3(IN) PTC1.P$1 ; also sheet 1
5V_IN_FUSE: C84.+ C91.1 D1.C JP5.2 L3.2 PTC1.P$2 R123.2
12VREG: C75.1 IC15.6 ; also sheet 3
DIR5: IC12.P14(DIR) JP18.2 ; also sheet 1
EN: R127.1 R128.1 U3.2(EN)
EN5: IC12.P23(^EN) JP18.1 ; also sheet 1
ETA_CURRENT: IC9.2(P3W) JP34.3
GND: C64.C(-) C65.2 C68.1 C71.2 C72.1 C73.2 C74.- C75.2 C84.- C90.2 C91.2 D2.A IC9.3(P3B) IC9.7(VSS) IC9.8(P1B) IC9.13(P0B) IC9.16(A1) IC9.18(P2B) IC10.1(ADJ) IC12.P13(GND1) IC12.P24(GND2) IC12.P$1(PAD) IC15.3 JP5.3 JP8.2 JP18.4 JP34.1 LED9.C Q4.3(S) Q5.S R19.2 R21.1 R79.1 R83.2 R86.2 R87.1 R124.1 R125.1 R126.1 R128.2 U3.5(GND) U3.PAD(GND) VR5.A ; supply symbol labelled AGND ; also sheet 1,2,3
GPIO_FET1: Q5.G R86.1 R88.1
MS1: IC12.P05(MS1) ; also sheet 2
MS2: IC12.P06(MS2) ; also sheet 2
MS3: IC12.P10(VDD) ; also sheet 2
N$29: IC9.15(!RESET) R4.1
N$52: D9.A LED11.C Q4.2(D) Q4.4(D) X9.2
N$56: IC9.1(P3A) IC9.10(P1A) IC9.11(P0A) IC9.20(P2A) R18.1
N$58: C69.2 IC12.P01(CP1)
N$59: C69.1 IC12.P02(CP2)
N$64: C70.2 IC12.P03(VCP)
N$65: IC12.P17(SENSE1) R21.2
N$66: IC12.P20(SENSE2) R79.2
N$70: IC12.P18(OUT1A) J5.2
N$71: IC12.P15(OUT1B) J5.1
N$72: IC12.P19(OUT2A) J5.3
N$76: IC12.P22(OUT2B) J5.4
N$79: IC12.P08(ROSC) R19.1 R80.1
N$80: LED9.A R77.1
N$83: C72.2 IC12.P04(VREG)
N$89: IC12.P09(^SLEEP) R20.1
N$95: IC12.P07(^RESET) R81.1
N$97: Q4.1(G) R82.1
N$100: LED11.A R84.2
N$109: LED12.C Q5.D U$7.P$1
N$110: LED12.A R85.2
N$113: IC15.7 R88.2
N$129: R116.1 VR5.E
N$138: SJ8.1 VR5.S
N$139: IC12.P12(REF) SJ8.2
N$148: C93.1 D2.C L3.1 U3.1(SW)
N$149: R123.1 R124.2 U3.4(FB)
N$150: C92.2 R125.2
N$151: R126.2 U3.6(FREQ)
N$152: C93.2 U3.8(BST)
N$153: C92.1 U3.3(COMP)
P1_22: R82.2 R83.1 ; also sheet 1
P1_23: IC15.2 R87.2 ; also sheet 1
POT_SCL: IC9.5(SCL) JP8.4 ; also sheet 1,2
POT_SDA: IC9.6(SDA) JP8.3 ; also sheet 1,2
PW5: IC9.12(P0W) SJ8.3
STP5: IC12.P11(STEP) JP18.3 ; also sheet 1
THETA_CURRENT: IC9.19(P2W) JP34.4
VBB: C70.1 C73.1 C74.+ D3.A D9.C IC12.P16(VBB1) IC12.P21(VBB2) R84.1 R85.1 U$7.P$2 X9.1 ; also sheet 2,3
VBB_REG: C90.1 D3.C R127.2 U3.7(VIN)
VUSB: D1.A ; also sheet 1
ZETA_CURRENT: IC9.9(P1W) JP34.2
Unconnected: IC9.14(NC) IC15.4 IC15.5

### Notes on the sheet
- MP1584芯片内部自带短路保护，短路电流阈值4.87A，去除过载后瞬时恢复。
  MP1584电源模块实测输入26.3V，输出5V3A，带载五分钟，温升35°C左右
  MP2565短路电流持续3.9A，没有烧片子
- MP2565参数
  典型输出5V/2.5A, 建议输入电压12-24V，开关频率500KHz
  适用MP1584
  此电路板基本按照datasheet的示例布板，修改R128为24.9k可以Pin to Pin使用MP1584，对于MP2565，R128为17.4k，详见datasheet P15和P16
  MP2565 与 MP1584
  MP2565相当于MP1584的高压版本，相比MP1584，MosFet耐压从28V提高到50V，对24V电压降压稳压更保险
  此DCDC芯片的demo板见https://github.com/oldgerman/MP2565_EVM_V1

## Library data of the parts
C1-C6 C8-C20 C25 C27 C28 C30-C38 C40 C41 C43 C44 C46 C47 C51-C59 C62 C65 C66 C68-C73 C75 C78-C83 C85 C93 = rcl:C-EU: CAPACITOR, European symbol
C7 C21-C24 C45 C50 C61 C64 = SparkFun:CAP_POL: Capacitor Polarized These are standard SMD and PTH capacitors. Normally 10uF, 47uF, and 100uF in electrolytic and tantalum varieties. Always verify the external diameter of the through hole cap, it varies with capacity, voltage, and manufacturer. The EIA devices should be standard.
C26 C29 C39 C42 C60 C63 C74 = SmoothieBoard_ODG:CAP_POL-MINI: Capacitor Polarized These are standard SMD and PTH capacitors. Normally 10uF, 47uF, and 100uF in electrolytic and tantalum varieties. Always verify the external diameter of the through hole cap, it varies with capacity, voltage, and manufacturer. The EIA devices should be standard.
C48 C49 C67 = resistor:C-EU: CAPACITOR, European symbol
C84 = SparkFun-Capacitors:CAP_POL: Capacitor Polarized These are standard SMD and PTH capacitors. Normally 10uF, 47uF, and 100uF in electrolytic and tantalum varieties. Always verify the external diameter of the through hole cap, it varies with capacity, voltage, and manufacturer. The EIA devices should be standard.
C90-C92 = microbuilder:CAP_CERAMIC: Ceramic Capacitors 0402 - 0402 Surface Mount Capacitors 16pF 50V 5% [Digikey: 445-4899-2-ND] 18pF 50V 5% [Digikey: 490-1281-2-ND] 22pF 50V 5% [Digikey: 490-1283-2-ND] 68pF 50V 5% [Digikey: 490-1289-2-ND] 0.1uF 10V 10% [Digikey: 490-1318-2-ND] 1.0uF 6.3V 10% [Digikey: 490-1320-2-ND] 0603 - 0603 Surface Mount Capacitors 16 pF 50V 5% [Digikey: 445-5051-2-ND] 22 pF 50V [Digikey: PCC220ACVTR-ND] 33 pF 50V 5% [Digikey: 490-1415-1-ND] 56pF 50V 5% [Digikey: 490-1421-1-ND] 220pF 50V 5% [Digikey: 445-1285-1-ND] 680 pF 50V 2200 pF 50V 5% C0G [Digikey: 445-1297-1-ND] 5600 pF 100V 5% X7R [Digikey: 478-3711-1-ND] 0.1 µF 25V 10% [Digikey: PCC2277TR-ND] 0.22 µF 16V 10% X7R [Digikey: 445-1318-1-ND] 1.0 µF 25V 10% [Digikey: 445-5146-2-ND] 0603 - RF Specific 3pF 250V +/-0.1pF RF [Digikey: 712-1347-1-ND] 18 pF 250V 5% [Digikey: 478-3505-1-ND or 712-1322-1-ND] 56 pF 250V 5% C0G RF [Digikey: 490-4867-1-ND] 68 pF 250V RF [Digikey: 490-4868-1-ND] 0805 - 0805 Surface Mount Capacitors 220 pF 250V 2% RF Ceramic Capacitor [Digikey: 712-1398-1-ND] 1000 pF 50V 2% NP0 Ceramic Capacitor [Digikey: 478-3760-1-ND] 0.1 µF 25V 10% Ceramic Capacitor [Digikey: PCC1828TR-ND] 1.0 µF 16V 10% Ceramic Capacitor[Digikey: 490-1691-2-ND] 10.0 µF 10V 10% Ceramic Capacitor[Digikey: 709-1228-1-ND] 10.0 uF 16V 10% Ceramic Capacitor [Digikey: 478-5165-2-ND] 47 uF 6.3V 20% Ceramic Capacitor [Digikey: 587-1779-1-ND or 399-5506-1-ND] 1206 - 1206 Surface Mount Capacitors 47uF 10V 20% Ceramic Capacitor [Digikey: 490-5528-1-ND or 399-5508-1-ND or 445-6010-1-ND] 100uF 6.3V -20%, +80% Y5V Ceramic Capacitor (Digikey: 490-4512-1-ND, Mouser: 81-GRM31CF50J107ZE1L)
D1-D4 D7-D9 = SmoothieBoard_ODG:SS34F
D5 = diode:ZENER-DIODE: Z-Diode
FB1 = microbuilder:FERRITE: Ferrite Bead 0603 MMZ1608B121C - 120 Ohm @ 100MHz, 600mA, 0.15 Ohm DC Resistance - Digikey: 445-2164-1-ND BK1608HW121-T - 120 Ohm, 600mA Ferrite Chip - Digikey: 587-1876-2-ND 0805 HZ0805B272R-10 - 2.7K Ohm @ 100MHz, 200mA, 0.8 Ohm DC Resistance - Digikey: 240-2504-1-ND (see also Murata BLM21BD272SN1L) MMZ2012Y152B - 1.5K Ohm @ 100MHz, 500mA, 0.4 Ohm DC Resistance - Digikey: 445-1560-1-ND - Mainly for high frequency (80-400MHz) MMZ2012R102A - 1K Ohm @ 100MHz, 500mA, 0.3 Ohm DC Resistance - Digikey: 445-1555-2-ND - More general purpose (10-200MHz)
FID1 FID2 = SmoothieBoard_ODG:FIDUCIAL: Fiducial Alignment Points Various fiducial points for machine vision alignment.
IC1 = microbuilder:LPC1768: LPC1768 100 MHz 32-bit ARM Cortex-M3 based microcontroller featuring a high level of integration and low power consumption. 512 kB Flash, 64 kB SRAM, USB Device/Host/OTG, Ethernet, CAN, I2S, 10-bit DAC Digikey: 568-4796-ND
IC2 IC3 IC5 IC6 IC12 = A4982:A4982
IC4 IC9 = Geos:MCP44X1: MCP44x1 MCP4451 - ? Quad Resistor Network ? I2C Serial Interface Support ? Potentiometer or Rheostat Configuration Options ? Resistor Network Resolution: 7-bit ? 128 Resistors (129 Taps) 8-bit ? 256 Resistors (257 Taps)
IC7 = microbuilder:74LVC1G04: 74LVC1G04 - Single Inverter Gate SOT23-5 SN74LVC1G04DBVR - Digikey: 296-11599-1-ND
IC8 = microbuilder:LAN8720: LAN8720A 10/100 Ethernet PHY Mouser: 886-LAN8720AI-CP
IC10 = SparkFun:V_REG_LM1117: Voltage Regulator LM1117 Standard adjustable voltage regulator but in SMD form. Spark Fun Electronics SKU : COM-00595
IC11 = linear:78L*: POSITOIV-VOLTAGE REGULATORS Output up to 100 mA Source: http://focus.ti.com/lit/ds/symlink/ua78l05.pdf
IC14 IC15 = custom_esorensen:TC4427
J1-J5 = con-amp:MTA04-100: AMP connector
J6 = sun-hole:MTA04-100: AMP connector
J12 = FUSB302:USB_C_LONG-SYMBOL: USB Type C 16Pin Connector Super Speed pins not available on the 16-pin purely SMD connector so this part is best for USB 2.0 implementations. D1 and D2 are tied together enabling D+/- no matter which way the cable is plugged into the connector. The two channel configuration pins (CC1/2) are exposed. These are normally connected to ground via 5.1k resistors but can be reconfigured for high current/high power applications.; PROD_ID: CONN-14122
JP1 JP8 JP10 = SparkFun-Connectors-psa-change-usb-c:CONN_04: Multi connection point. Often used as Generic Header-pin footprint for 0.1 inch spaced/style header connections On any of the 0.1 inch spaced packages, you can populate with these: Break Away Headers - Straight <https://www.sparkfun.com/products/116> (PRT-00116) Break Away Male Headers - Right Angle <https://www.sparkfun.com/products/553> (PRT-00553) Female Headers <https://www.sparkfun.com/products/115> (PRT-00115) Break Away Headers - Machine Pin <https://www.sparkfun.com/products/117> (PRT-00117) Break Away Female Headers - Swiss Machine Pin <https://www.sparkfun.com/products/743> (PRT-00743) For SCREWTERMINALS and SPRING TERMINALS visit here: Screw Terimnals on SparkFun.com <https://www.sparkfun.com/search/results?term=Screw+Terminals> (5mm/3.5mm/2.54mm spacing) This device is also useful as a general connection point to wire up your design to another part of your project. Our various solder wires solder well into these plated through hole pads. Hook-Up Wire - Assortment (Stranded, 22 AWG) <https://www.sparkfun.com/products/11375> (PRT-11375) Hook-Up Wire - Assortment (Solid Core, 22 AWG) <https://www.sparkfun.com/products/11367> (PRT-11367) View the entire wire category on our website here <https://www.sparkfun.com/categories/141> Special notes: Molex polarized connector foot print use with SKU : PRT-08231 with associated crimp pins and housings. 1MM SMD Version SKU: PRT-10208; PROD_ID: CONN-09696
JP2-JP4 JP6 = SparkFun-Connectors:CONN_03: Multi connection point. Often used as Generic Header-pin footprint for 0.1 inch spaced/style header connections On any of the 0.1 inch spaced packages, you can populate with these: Break Away Headers - Straight <https://www.sparkfun.com/products/116> (PRT-00116) Break Away Male Headers - Right Angle <https://www.sparkfun.com/products/553> (PRT-00553) Female Headers <https://www.sparkfun.com/products/115> (PRT-00115) Break Away Headers - Machine Pin <https://www.sparkfun.com/products/117> (PRT-00117) Break Away Female Headers - Swiss Machine Pin <https://www.sparkfun.com/products/743> (PRT-00743) Stackable Header - 3 Pin (Female, 0.1") <https://www.sparkfun.com/products/13875> (PRT-13875) For SCREWTERMINALS and SPRING TERMINALS visit here: Screw Terimnals on SparkFun.com <https://www.sparkfun.com/search/results?term=Screw+Terminals> (5mm/3.5mm/2.54mm spacing) This device is also useful as a general connection point to wire up your design to another part of your project. Our various solder wires solder well into these plated through hole pads. Hook-Up Wire - Assortment (Stranded, 22 AWG) <https://www.sparkfun.com/products/11375> (PRT-11375) Hook-Up Wire - Assortment (Solid Core, 22 AWG) <https://www.sparkfun.com/products/11367> (PRT-11367) View the entire wire category on our website here <https://www.sparkfun.com/categories/141> Special notes: Molex polarized connector foot print use with SKU : PRT-08232 with associated crimp pins and housings.; PROD_ID: XXX-00000
JP5 JP14 JP16 JP19-JP22 JP26 = SparkFun:M03: Header 3 Standard 3-pin 0.1" header. Use with straight break away headers (SKU : PRT-00116), right angle break away headers (PRT-00553), swiss pins (PRT-00743), machine pins (PRT-00117), and female headers (PRT-00115). Molex polarized connector foot print use with SKU : PRT-08232 with associated crimp pins and housings.
JP7 JP9 JP12 JP15 JP18 JP29 JP34 = SparkFun-Connectors:CONN_04: Multi connection point. Often used as Generic Header-pin footprint for 0.1 inch spaced/style header connections On any of the 0.1 inch spaced packages, you can populate with these: Break Away Headers - Straight <https://www.sparkfun.com/products/116> (PRT-00116) Break Away Male Headers - Right Angle <https://www.sparkfun.com/products/553> (PRT-00553) Female Headers <https://www.sparkfun.com/products/115> (PRT-00115) Break Away Headers - Machine Pin <https://www.sparkfun.com/products/117> (PRT-00117) Break Away Female Headers - Swiss Machine Pin <https://www.sparkfun.com/products/743> (PRT-00743) For SCREWTERMINALS and SPRING TERMINALS visit here: Screw Terimnals on SparkFun.com <https://www.sparkfun.com/search/results?term=Screw+Terminals> (5mm/3.5mm/2.54mm spacing) This device is also useful as a general connection point to wire up your design to another part of your project. Our various solder wires solder well into these plated through hole pads. Hook-Up Wire - Assortment (Stranded, 22 AWG) <https://www.sparkfun.com/products/11375> (PRT-11375) Hook-Up Wire - Assortment (Solid Core, 22 AWG) <https://www.sparkfun.com/products/11367> (PRT-11367) View the entire wire category on our website here <https://www.sparkfun.com/categories/141> Special notes: Molex polarized connector foot print use with SKU : PRT-08231 with associated crimp pins and housings. 1MM SMD Version SKU: PRT-10208; PROD_ID: CONN-09696
JP11 JP27 = jumper:JP1E: JUMPER
JP13 JP30 JP31 JP36 = SparkFun:JUMPER-2: Jumper Basic 0.1" spaced jumper. Use with breakaway headers.
JP23 JP24 JP35 = SparkFun:M02: Header 2 Standard 2-pin 0.1" header. Use with straight break away headers (SKU : PRT-00116), right angle break away headers (PRT-00553), swiss pins (PRT-00743), machine pins (PRT-00117), and female headers (PRT-00115). Molex polarized connector foot print use with SKU : PRT-08233 with associated crimp pins and housings.
JP25 = SparkFun-Connectors:M03: Header 3 Standard 3-pin 0.1" header. Use with straight break away headers (SKU : PRT-00116), right angle break away headers (PRT-00553), swiss pins (PRT-00743), machine pins (PRT-00117), and female headers (PRT-00115). Molex polarized connector foot print use with SKU : PRT-08232 with associated crimp pins and housings.
JP28 = SmoothieBoard_ODG:JP1E-SMSP: JUMPER
JP32 JP33 = SparkFun:M05: Header 5 Standard 5-pin 0.1" header. Use with straight break away headers (SKU : PRT-00116), right angle break away headers (PRT-00553), swiss pins (PRT-00743), machine pins (PRT-00117), and female headers (PRT-00115). Molex polarized connector foot print use with SKU : PRT-08230 with associated crimp pins and housings.
L1 = microbuilder:INDUCTOR: Inductors 0603: 10nH Ceramic Inductor - microwire antenna/RF (Digikey: 712-1434-2-ND) 0805: 560nH Ceramic Inductor - RF (Digikey: 553-1047-1-ND) 270nH Ceramic Inductor - Q = 40@250MHz, +-5%, 1 Ohm DC Resistance (Digikey: 535-10506-2-ND) 1007 (2518 Metric) SMT: 10µH 10% 250mOhm 820mA 1007 Inductor (Digikey: 587-2189-1-ND) 22µH 10% 500mOhm 580mA 1007 Inductor (Digikey: 587-2190-1-ND) 47µH 10% 950mOhm 420mA 1007 Inductor (Digikey: 587-2191-1-ND) 47µH 5% 100mOhm 1A 1008 Inductor (Digikey: 732-1816-1-ND) 5.0x5.0mm (Taiyo Yuden NR5040 Series) 6.8µH 20% 2.3A 64mOhm Inductor (Digikey: 587-2374-2-ND) 5.0x5.0mm (TDK VLC5045 Series) 4.7µH 20% 3.3A 34mOhm Inductor (Digikey: 445-6526-1-ND) 6.8µH 20% 2.7A 46mOhm Inductor (Digikey: 445-6527-1-ND) 6.0x6.0mm (TDK VLC6045 Series) 4.7µH 20% 3.8A 27mOhm Inductor (Digikey: 445-6538-2-ND) 6.8µH 20% 3A 41mOhm Inductor (Digikey: 445-6540-1-ND) 6.2µH 30% 2.2A 45mOhm Inductor (Digikey: SRR5028-6R2YCT-ND) - Not TDK VLC6045 but footprint should match 6.0x6.0mm (TDK SLF6045 Series) 6.8uH 30% 2A 33mOhm Inductor (Digikey: 445-4572-1-ND, Mouser: 810-SLF645T6R8N2R0PF)
L3 = DIP:INDUCTOR
LED1-LED12 = microbuilder:LED: LED 0603 - 0603 Surface Mount Package 2mA: Green LED - Low Power (3.9mcd, 2ma, 1.7Vf) - Digikey: 475-2709-2-ND Orange LED - Low Power (9.8mcd, 2ma, 1.8Vf) - Digikey: 475-1194-2-ND Red LED - Low Power (5mcd, 2ma, 1.8Vf) - Digikey: 475-1195-2-ND Yellow LED - Low Power (7mcd, 2ma, 1.8Vf) - Digikey: 475-1196-2-ND 5mA: Blue LED - Low Power (17mcd, 5ma, 2.9Vf) - Digikey: LNJ937W8CRACT-ND 0805 - 0805 Surface Mount Package 2mA: Red LED (8.8mcd, 2mA, 1.8Vf, Clear) - Low Power [Digikey: 475-2510-1-ND] Green LED (5mcd, 2mA, 1.8Vf, Clear) - Low Power [Digikey: 475-2730-1-ND] Yellow LED (11.3mcd, 2mA, 1.8Vf, Clear) - Low Power [Digikey: 475-2555-1-ND] 20mA: Red LED (104mcd, 20mA, Diffused) - LS R976 [Digikey: 475-1278-6-ND] Red LED (12mcd, 20mA, 2.0Vf, Clear) - APT2012EC [Digikey: 754-1128-1-ND] Green LED (15mcd, 20mA, 2.2Vf, Clear) - APT2012GC [Digikey: 754-1131-1-ND] Orange LED (160mcd, 20mA, 2.1Vf, Clear) - APT2012SECK [Digikey: 754-1130-1-ND] 1206 - 1206 Surface Mount Package Green LED (26mcd, 20mA, Diffused) - LG N971 [Digikey: 475-1407-6-ND] Red LED (15mcd, 20mA, Diffused) - LH N974 [Digikey: 475-1416-6-ND]
POWER U$7 = eric_sorensen:5.08MM_CONN
PTC1 = microbuilder:PTC: PTC (Resettable Fuse) 1206 Package 250mA PTC (16V Max, Time-to-Trip: 0.08s) - Digikey: F2110CT-ND 1210 Package 100mA PTC (30V Max, Time-to-Trip: 0.6s) - Digikey: MF-USMF010-2CT-ND 1812 Package 750mA PTC (24V Max, Time-to-Trip: 0.2s) - Digikey: MF-MSMF075/24-2CT-ND
Q1 = microbuilder:MOSFET-P: P-Channel Mosfet LEGEND VDS: Voltage Drain-Source ID: Drain Current RDS(ON): Drain-Source On-State Resistance VGS(TH): Gate-Source Threshold Voltage CISS: Drain-Source Input Capacitance SOT-23 Name VDS ID RDS(ON) VGS(TH) CISS Order Number IRLML5103 30V 760mA 600 mOhm -- 75pF @ 25V Digikey: IRLML5103PBFCT-ND IRLML6401 12V 4.3A 50 mOhm 950mV @ 250µA 830pF @ 10V Digikey: IRLML6401PBFTR-ND NTR0202PL 20V 400mA 800 mOhm 2.3V @ 250uA 70pF @ 5V Digikey: NTR0202PLT1GOSTR-ND NTR4101PT1G 20V 1.8A 85 mOhm 1.2V @ 250uA 675pF @ 10V Digikey: NTR4101PT1GOSCT-ND DMP2004K 20V 600mA 900 mOhm 1V @ 250uA 175pF @ 16V Digikey: DMP2004KDICT-ND PMV65XP 20V 3.9A 76 mOhm 950mV @ 1mA 725pF @ 20V Digikey: 568-2358-2-ND TO-252 Name VDS ID RDS(ON) VGS(TH) CISS Order Number AOD417 30V 25A 34 mOhm 3V @ 250µA 920pF @ 15V Digikey: 785-1106-2-ND
Q2 Q3 = microbuilder:CRYSTAL: Crystals HC49UP - Surface Mount Crystal 4.0MHz 18pF +/-30ppm Surface Mount Crystal [Digikey: 535-9857-1-ND] 12.0 MHz Surface Mount Crystal [Digikey: 535-9869-6-ND] 25.0 MHz Surface Mount Crystal [Digikey: 535-9078-1-ND] 2.5 x 2.0mm - MEMs SMT Crystal 16.0 MHz 10pF 20ppm 2.5 x 2.0mm Crystal [Digikey -40-85°C: 535-10923-1-ND] 3.2 x 2.5mm - MEMs SMT Crystal 12.0 MHz 8pF 15ppm 3.2 x 2.5mm Crystal [Digikey: -10-70°C: 644-1047-1-ND -40-125°C: 644-1128-1-ND] 16.0 MHz 8pF 15ppm 3.2 x 2.5mm Crystal [Digikey: -10-70°C: 644-1049-1-ND -40-125°C: 644-1129-2-ND] 16.0 MHz 10pF 10ppm 3.2 x 2.5mm Crystal [Digikey: 644-1100-1-ND] 27.12 MHz 18pF 30ppm 3.2 x 2.5mm Crystal [Digikey: 887-1424-1-ND] 27.12MHz 10pF 10ppm 3.2 x 2.5mm Crystal [Digikey: 887-1329-1-ND] 4.9 x 1.8mm - MEMs SMT Crystal 32.768 KHz 12.5pF 20ppm 4.9 x 1.8mm Crystal [Digikey: SE2415CT-ND] 8.0 x 3.8mm - Surface Mount Crystal 32.768kHz 12.5pF 20ppm -40°C-85°C [Digikey: 535-9166-2-ND] Cylinder 32.768KHz Cylinder Crystal (2x6mm body) [Ex. Digikey: 300-8341-2-ND]
Q4 Q8 Q9 = ipc-7351-transistor:MOSFET-NCH_
Q5-Q7 = transistor-power:IRF540: HEXFET Power MOSFET
Q10 = transistor-fet:SPD30P06P: SIPMOS(R) Power-Transistor P-Channel, Enhancement mode Source: http://www.infineon.com/upload/Document/cmc_upload/documents/012/3615/SPD_U30P06P.pdf
R1-R20 R22-R30 R35-R45 R50-R78 R80-R116 = resistor:R-US_: RESISTOR, American symbol
R21 R31-R34 R46-R49 R79 R123-R128 = microbuilder:RESISTOR: Resistors 0402 - 0402 Surface Mount Package 22 Ohm 1% 1/16W [Digikey: 311-22.0LRTR-ND] 33 Ohm 5% 1/16W 1.0K 5% 1/16W 1.5K 5% 1/16W 2.0K 1% 1/16W 10.0K 1% 1/16W [Digikey: 311-10.0KLRTR-ND] 10.0K 5% 1/16W [Digikey: RMCF0402JT10K0TR-ND] 12.1K 1% 1/16W [Digikey: 311-22.0LRTR-ND] 100.0K 5% 1/16W 0603 - 0603 Surface Mount Package 0 Ohm 1/10 Watt 1% Resistor 15 Ohm 1/10 Watt 1% Resistor 33 Ohm 1/10 Watt 1% Resistor 49.9 Ohm 1/10 Watt 1% Resistor 100 Ohm 1/10 Watt 1% Resistor 150 Ohm 1/10 Watt 1% Resistor 240 Ohm 1/10 Watt 1% Resistor 390 Ohm 1/10 Watt 1% Resistor 560 Ohm 1/10 Watt 1% Resistor 680 Ohm 1/10 Watt 1% Resistor 750 Ohm 1/10 Watt 1% Resistor 1.0K Ohm 1/10 Watt 1% Resistor 1.5K Ohm 1/10 Watt 1% Resistor 2.0K Ohm 1/10 Watt 1% Resistor 2.2K Ohm 1/10 Watt 1% Resistor 3.3K Ohm 1/10 Watt 1% Resistor 4.7K Ohm 1/10 Watt 1% Resistor 10.0K Ohm 1/10 Watt 1% Resistor 12.0K Ohm 1/10 Watt 1% Resistor 12.1K Ohm 1/10 Watt 1% Resistor 20.0K Ohm 1/10 Watt 1% Resistor 33.0K Ohm 1/10 Watt 1% Resistor 100.0K Ohm 1/10 Watt 1% Resistor 0805 - 0805 Surface Mount Package 0 Ohm 1/8 Watt 1% Resistor 33 Ohm 1/8 Watt 1% Resistor 100 Ohm 1/8 Watt 1% Resistor 150 Ohm 1/8 Watt 1% Resistor 200 Ohm 1/8 Watt 1% Resistor 240 Ohm 1/8 Watt 1% Resistor 330 Ohm 1/8 Watt 1% Resistor 390 Ohm 1/8 Watt 1% Resistor 470 Ohm 1/8 Watt 1% Resistor 1.0K Ohm 1/8 Watt 1% Resistor 1.5K Ohm 1/8 Watt 1% Resistor 2.0K Ohm 1/8 Watt 1% Resistor 4.7K Ohm 1/8 Watt 1% Resistor 5.1K Ohm 1/8 Watt 1% Resistor 5.6K Ohm 1/8 Watt 1% Resistor 10.0K Ohm 1/8 Watt 1% Resistor 22.0K Ohm 1/8 Watt 1% Resistor 33.0K Ohm 1/8 Watt 1% Resistor 100K Ohm 1/8 Watt 1% Resistor 1206 - 1206 Surface Mount Package 2012 - 2010 Surface Mount Package 0.11 Ohm 1/2 Watt 1% Resistor - Digikey: RHM.11UCT-ND
RJ1 = Itead_BP_110825.lbr:HR911105A: SOC006
S1 S2 = SparkFun:TAC_SWITCH: Momentary Switch Button commonly used for reset or general input. Spark Fun Electronics SKU : COM-00097
S3 = Local Library:SWITCH-MOMENTARY-LED
SJ1-SJ8 = SparkFun:SOLDERJUMPER_2WAY: Solder Jumper 2 way solder jumper
SL1 = SparkFun-Connectors:CONN_08: Multi connection point. Often used as Generic Header-pin footprint for 0.1 inch spaced/style header connections On any of the 0.1 inch spaced packages, you can populate with these: Break Away Headers - Straight <https://www.sparkfun.com/products/116> (PRT-00116) Break Away Male Headers - Right Angle <https://www.sparkfun.com/products/553> (PRT-00553) Female Headers <https://www.sparkfun.com/products/115> (PRT-00115) Break Away Headers - Machine Pin <https://www.sparkfun.com/products/117> (PRT-00117) Break Away Female Headers - Swiss Machine Pin <https://www.sparkfun.com/products/743> (PRT-00743) Arduino Stackable Header - 8 Pin <https://www.sparkfun.com/products/9279> (PRT-09279) For SCREWTERMINALS and SPRING TERMINALS visit here: Screw Terimnals on SparkFun.com <https://www.sparkfun.com/search/results?term=Screw+Terminals> (5mm/3.5mm/2.54mm spacing) This device is also useful as a general connection point to wire up your design to another part of your project. Our various solder wires solder well into these plated through hole pads. Hook-Up Wire - Assortment (Stranded, 22 AWG) <https://www.sparkfun.com/products/11375> (PRT-11375) Hook-Up Wire - Assortment (Solid Core, 22 AWG) <https://www.sparkfun.com/products/11367> (PRT-11367) View the entire wire category on our website here <https://www.sparkfun.com/categories/141> Special notes: Molex polarized connector foot print use with SKU : PRT-08231 with associated crimp pins and housings. 1MM SMD Version SKU: PRT-10208 NOTES ON THE VARIANTS LOCK and LOCK_LONGPADS... This footprint was designed to help hold the alignment of a through-hole component (i.e. 6-pin header) while soldering it into place. You may notice that each hole has been shifted either up or down by 0.005 of an inch from it's more standard position (which is a perfectly straight line). This slight alteration caused the pins (the squares in the middle) to touch the edges of the holes. Because they are alternating, it causes a "brace" to hold the component in place. 0.005 has proven to be the perfect amount of "off-center" position when using our standard breakaway headers. Although looks a little odd when you look at the bare footprint, once you have a header in there, the alteration is very hard to notice. Also,if you push a header all the way into place, it is covered up entirely on the bottom side.; PROD_ID: CONN-08438
U1 = SparkFun:USD-SOCKET: microSD Socket Push-push type uSD socket. Schematic element and footprint production proven. Spark Fun Electronics SKU : PRT-00127. tDoc lines correctly indicate media card edge positions when inserting (unlocked, locked, depressed).
U3 = DIP:MP2565DN
U$5 U$6 U$10 = eric_sorensen:5.08MM_CONN-NO-SIDE
U$9 = logxen:OSHW-LOGO: Open Source Hardware Logo This logo indicates the piece of hardware it is found on incorporates a OSHW license and/or adheres to the definition of open source hardware found here: http://freedomdefined.org/OSHW
U$11 U$12 = OSHWA:CERT
U$13 U$14 U$16 U$18 = DIP:SUN_HOLE_M3
VD1 = ESD-protection:USBLC6-2
VR1-VR5 = microbuilder:TRIMPOT: Potentiometers 3mm 10K Single Turn - Digikey: 3303W-103ETR-ND 3mm 100K Single Turn - Digikey: 3303X-104ETR-ND
X1 X7-X9 = con-weidmueller-sl35:180G-2: WEIDMUELLER CLAMP CONNECTOR; OC_FARNELL: unknown; OC_NEWARK: unknown